# EAGLE schematic kicker (EAGLE 9.6.1)
DCHECKED: 08/28/19; DDRAWN: 08/04/19; DWG_NO: 1; FINISH: HASL; MATERIAL: FR-4; NCHECKED: Ryo Osawa; NDRAWN: Will Stuckey; REV: 3.2; SCALE: 1:1; TITLE: SSL Kicker

## Sheet 1 of 9: Power
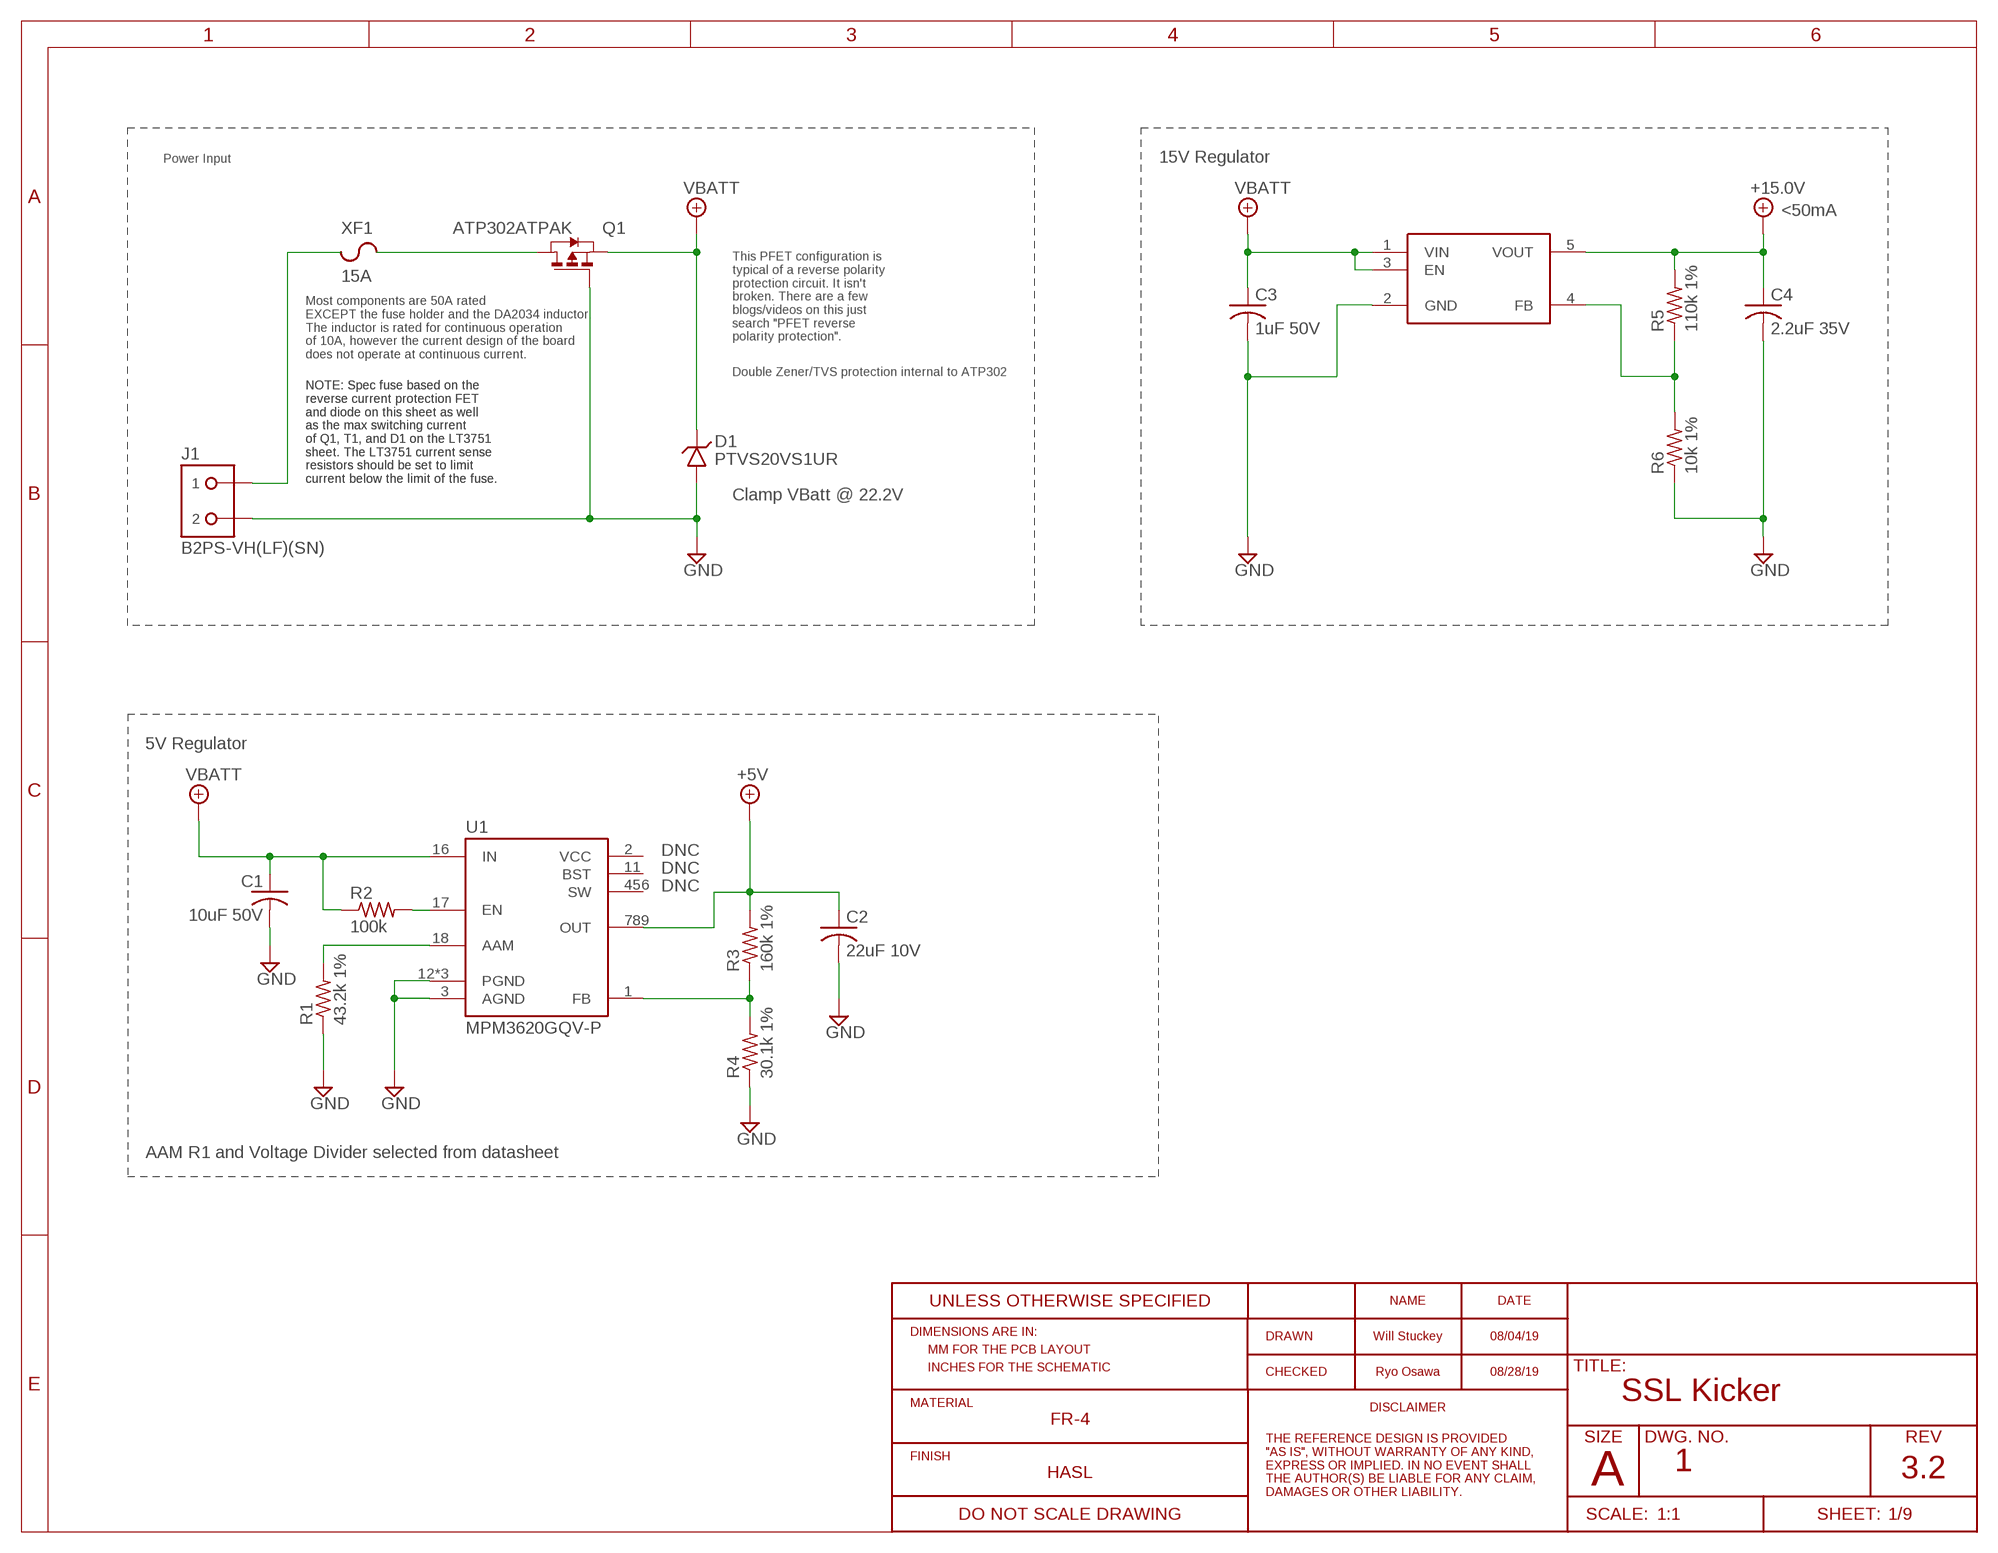
[diagram p0: schematic, sheet 1]
FRAME1 (RO_FRAME_A_L_20161226): REV: 3.2

### Parts
C1  10uF 50V  C-USC1206  [C1206]
C2  22uF 10V  C-USC0603  [C0603]
C3  1uF 50V  C-USC0603  [C0603]
C4  2.2uF 35V  C-USC0603  [C0603]
D1  PTVS20VS1UR  TVSSOD123W  [SOD123-W]
J1  B2PS-VH(LF)(SN)  [B2PS-CENTERED]
Q1  ATP302ATPAK  [TO460P950X150-3]
R1  43.2k 1%  R-US_R0603  [R0603]
R2  100k  R-US_R0603  [R0603]
R3  160k 1%  R-US_R0603  [R0603]
R4  30.1k 1%  R-US_R0603  [R0603]
R5  110k 1%  R-US_R0603  [R0603]
R6  10k 1%  R-US_R0603  [R0603]
U1  MPM3620GQV-P  [MPM3620GQV-P]
U2  15V  MIC5235YM5SOT-23-5  [SOT95P280X145-5]
XF1  15A  3557-2  [3557-2]

### Nets
+5V: C2.1 R3.2 U1.789(OUT) ; also sheet 3,6,7,8,9
+15.0V: C4.1 R5.2 U2.5(VOUT) ; also sheet 4,7
FB: R3.1 R4.2 U1.1(FB)
GND: C1.2 C2.2 C3.2 C4.2 D1.A J1.2 Q1.1(G) R1.1 R4.1 R6.1 U1.3(AGND) U1.12(PGND) U1.13(PGND) U1.14(PGND) U2.2(GND) ; also sheet 2,3,4,5,6,7,8,9
N$9: Q1.3(D) XF1.3 XF1.4
N$16: R5.1 R6.2 U2.4(FB)
N$39: J1.1 XF1.1 XF1.2
REG_AAM: R1.2 U1.18(AAM)
REG_EN: R2.2 U1.17(EN)
VBATT: C1.1 C3.1 D1.C Q1.2(S) R2.1 U1.16(IN) U2.1(VIN) U2.3(EN) ; also sheet 2,3,5
Unconnected: U1.2(VCC) U1.11(BST) U1.456(SW)

### Notes on the sheet
- Power Input | 15V Regulator
- <50mA
- This PFET configuration is 
  typical of a reverse polarity 
  protection circuit. It isn't 
  broken. There are a few 
  blogs/videos on this just 
  search "PFET reverse 
  polarity protection".
- Most components are 50A rated
  EXCEPT the fuse holder and the DA2034 inductor.
  The inductor is rated for continuous operation
  of 10A, however the current design of the board 
  does not operate at continuous current.
- Double Zener/TVS protection internal to ATP302
- NOTE: Spec fuse based on the
  reverse current protection FET
  and diode on this sheet as well
  as the max switching current
  of Q1, T1, and D1 on the LT3751
  sheet. The LT3751 current sense
  resistors should be set to limit
  current below the limit of the fuse.
- NOTE: Spec fuse based on the
  reverse current protection FET
  and diode on this sheet as well
  as the max switching current
  of Q1, T1, and D1 on the LT3751
  sheet. The LT3751 current sense
  resistors should be set to limit
  current below the limit of the fuse.
- Clamp VBatt @ 22.2V
- 5V Regulator
- DNC
- DNC
- DNC
- AAM R1 and Voltage Divider selected from datasheet

## Sheet 2 of 9: HV - Regulation
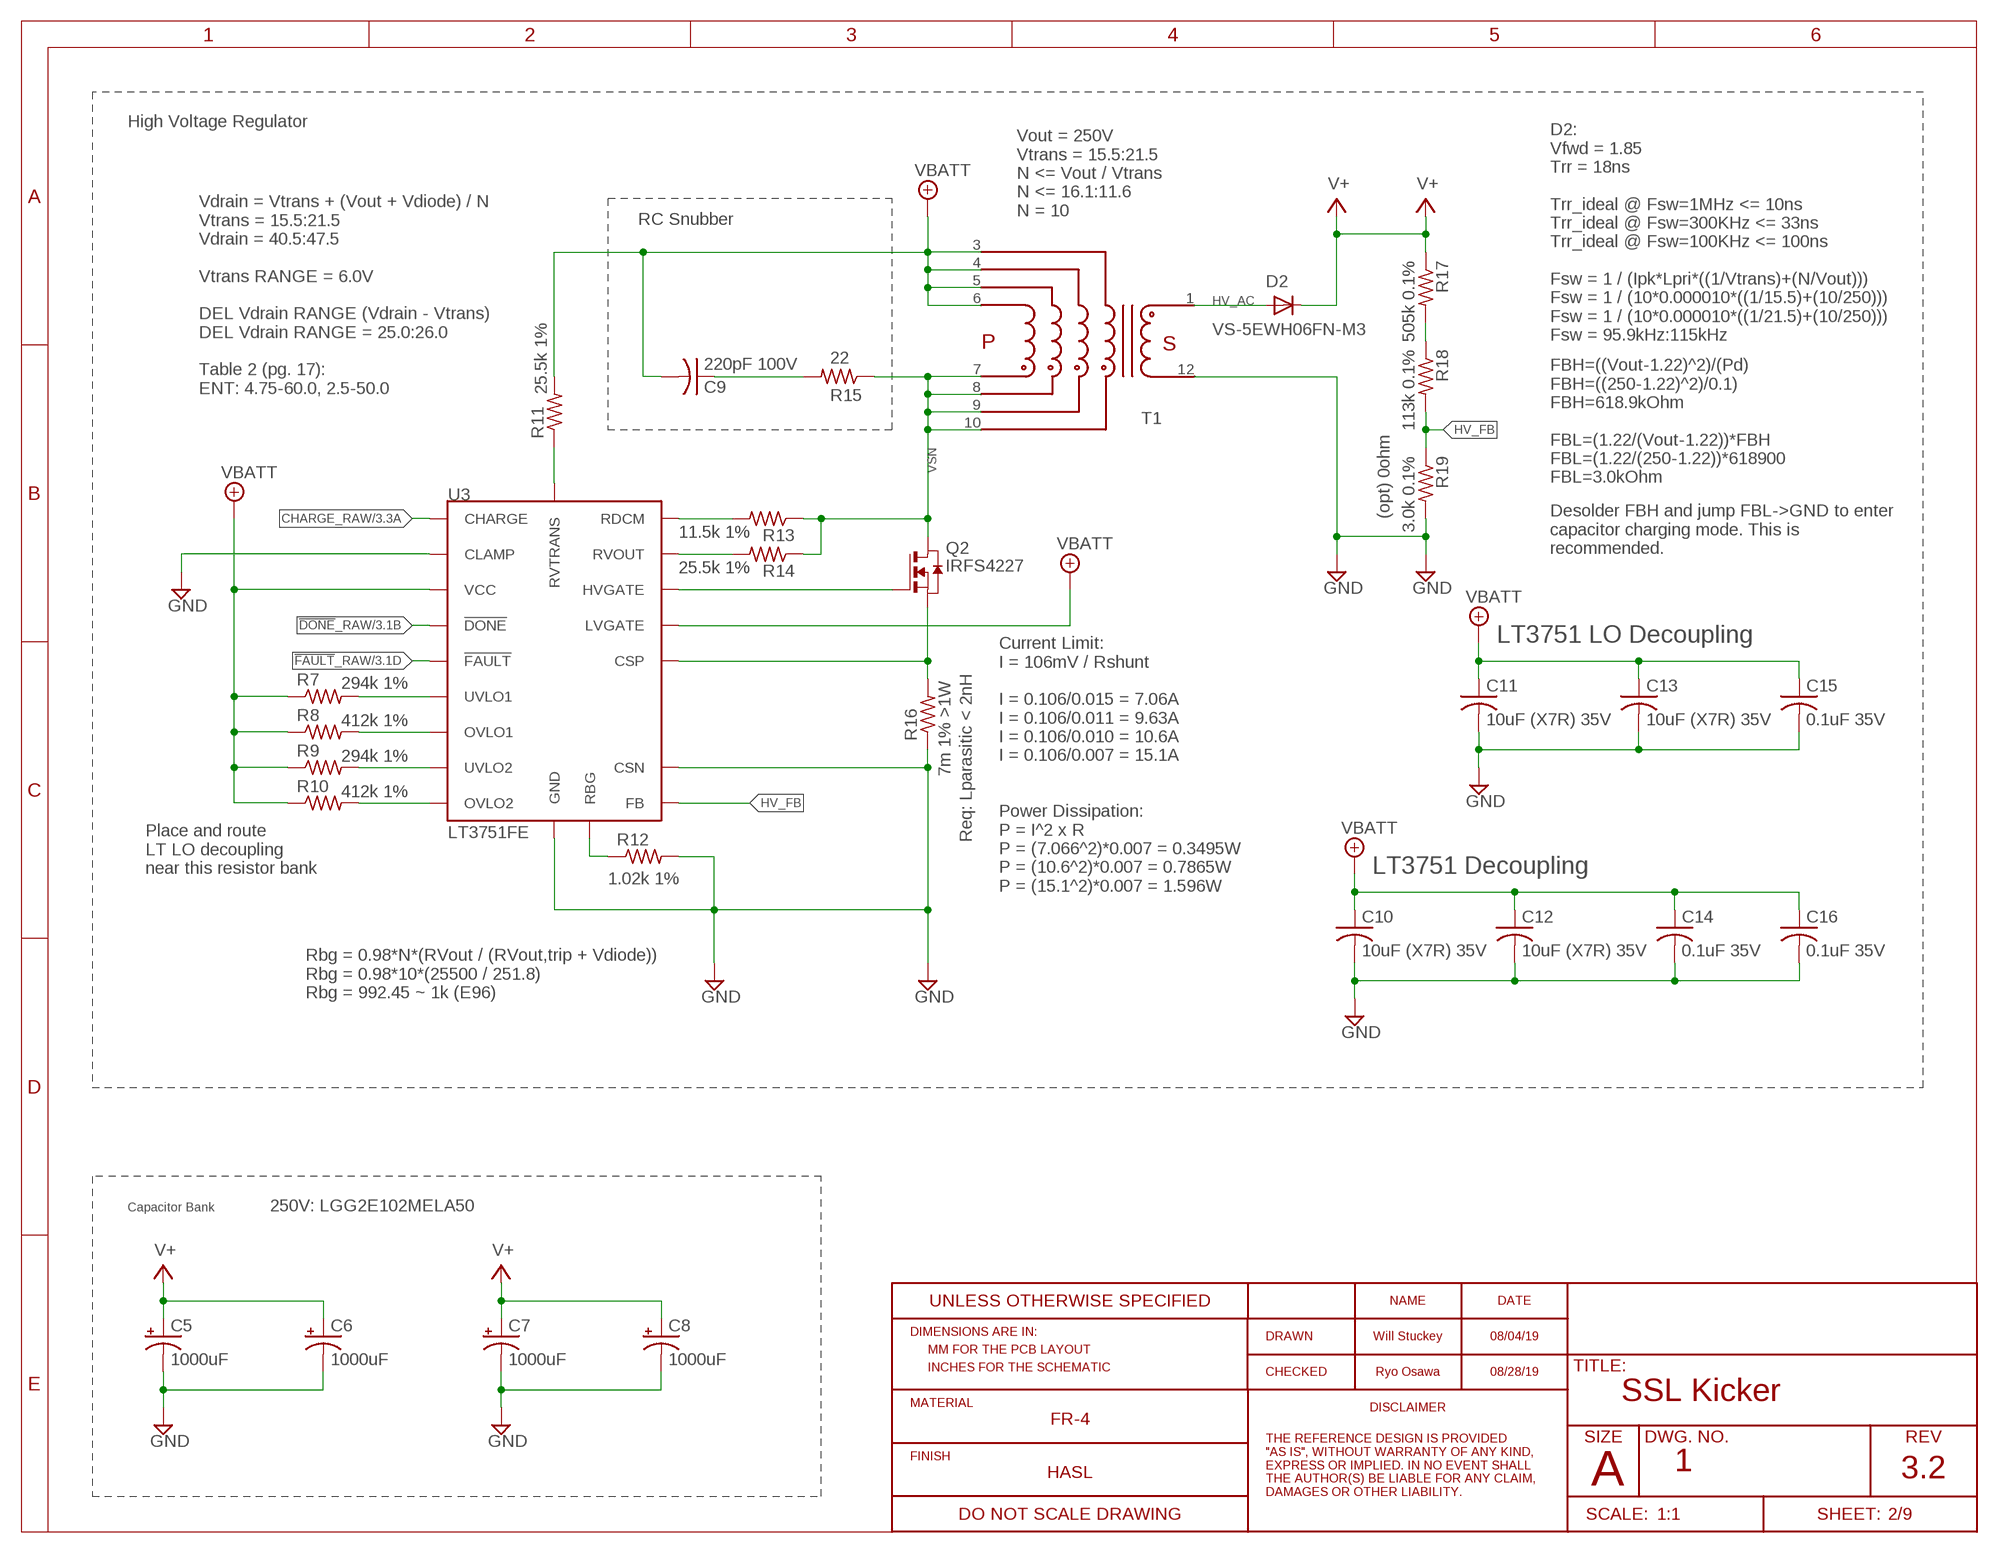
[diagram p1: schematic, sheet 2]
FRAME2 (RO_FRAME_A_L_20161226): REV: 3.2

### Parts
C5  1000uF  CPOL-USEB25D  [EB25D]
C6  1000uF  CPOL-USEB25D  [EB25D]
C7  1000uF  CPOL-USEB25D  [EB25D]
C8  1000uF  CPOL-USEB25D  [EB25D]
C9  220pF 100V  C-USC0805  [C0805]
C10  10uF (X7R) 35V  C-USC1210  [C1210]
C11  10uF (X7R) 35V  C-USC1210  [C1210]
C12  10uF (X7R) 35V  C-USC1210  [C1210]
C13  10uF (X7R) 35V  C-USC1210  [C1210]
C14  0.1uF 35V  C-USC0603  [C0603]
C15  0.1uF 35V  C-USC0603  [C0603]
C16  0.1uF 35V  C-USC0603  [C0603]
D2  VS-5EWH06FN-M3  VS-5EWH06FN-M3D-PAK_TO252AA  [TO460P990X239-3]
Q2  IRFS4227  [D2PAK]
R7  294k 1%  R-US_R0603  [R0603]
R8  412k 1%  R-US_R0603  [R0603]
R9  294k 1%  R-US_R0603  [R0603]
R10  412k 1%  R-US_R0603  [R0603]
R11  25.5k 1%  R-US_R0603  [R0603]
R12  1.02k 1%  R-US_R0805  [R0805]
R13  11.5k 1%  R-US_R0805  [R0805]
R14  25.5k 1%  R-US_R0805  [R0805]
R15  22  R-US_R0805  [R0805]
R16  7m 1% >1W  R-US_R2512  [R2512]
R17  505k 0.1%  R-US_R0603  [R0603]
R18  113k 0.1%  R-US_R0603  [R0603]
R19  3.0k 0.1%  R-US_R0603  [R0603]
T1  DA203X-ALDA2034  [DA2034]
U3  LT3751FE  [TSSOP-20_EP]

### Nets
!DONE!_RAW: U3.7(!DONE) ; also sheet 3,7
!FAULT!_RAW: U3.6(!FAULT) ; also sheet 3,7
CHARGE_RAW: U3.8(CHARGE) ; also sheet 3
CSP: Q2.3(S) R16.2 U3.12(CSP)
GND: C5.- C6.- C7.- C8.- C10.2 C11.2 C12.2 C13.2 C14.2 C15.2 C16.2 R12.2 R16.1 R19.2 T1.12 U3.9(CLAMP) U3.11(CSN) U3.PAD(GND) ; also sheet 1,3,4,5,6,7,8,9
HV_AC: D2.2(A) T1.1
HV_FB: R18.2 R19.1 U3.10(FB)
HVGATE: Q2.1(G) U3.15(HVGATE)
N$1: R12.1 U3.16(RBG)
N$2: R17.2 R18.1
N$18: C9.1 R15.2
N$24: R11.1 U3.1(RVTRANS)
OVLO1: R8.2 U3.3(OVLO1)
OVLO2: R10.2 U3.5(OVLO2)
RDCM: R13.2 U3.20(RDCM)
RVOUT: R14.2 U3.18(RVOUT)
UVLO1: R7.2 U3.2(UVLO1)
UVLO2: R9.2 U3.4(UVLO2)
V+: C5.+ C6.+ C7.+ C8.+ D2.3(C) R17.1 ; also sheet 4,5,6,7
VBATT: C9.2 C10.1 C11.1 C12.1 C13.1 C14.1 C15.1 C16.1 R7.1 R8.1 R9.1 R10.1 R11.2 T1.3 T1.4 T1.5 T1.6 U3.13(VCC) U3.14(LVGATE) ; also sheet 1,3,5
VSN: Q2.2(D) R13.1 R14.1 R15.1 T1.7 T1.8 T1.9 T1.10

### Notes on the sheet
- High Voltage Regulator
- Vout = 250V
  Vtrans = 15.5:21.5
  N <= Vout / Vtrans
  N <= 16.1:11.6
  N = 10
- RC Snubber
- D2:
  Vfwd = 1.85
  Trr = 18ns
  
  Trr_ideal @ Fsw=1MHz <= 10ns
  Trr_ideal @ Fsw=300KHz <= 33ns
  Trr_ideal @ Fsw=100KHz <= 100ns
  
  Fsw = 1 / (Ipk*Lpri*((1/Vtrans)+(N/Vout)))
  Fsw = 1 / (10*0.000010*((1/15.5)+(10/250)))
  Fsw = 1 / (10*0.000010*((1/21.5)+(10/250)))
  Fsw = 95.9kHz:115kHz
- Vdrain = Vtrans + (Vout + Vdiode) / N
  Vtrans = 15.5:21.5
  Vdrain = 40.5:47.5
  
  Vtrans RANGE = 6.0V
  
  DEL Vdrain RANGE (Vdrain - Vtrans)
  DEL Vdrain RANGE = 25.0:26.0
  
  Table 2 (pg. 17):
  ENT: 4.75-60.0, 2.5-50.0
- FBH=((Vout-1.22)^2)/(Pd)
  FBH=((250-1.22)^2)/0.1)
  FBH=618.9kOhm
  
  FBL=(1.22/(Vout-1.22))*FBH
  FBL=(1.22/(250-1.22))*618900
  FBL=3.0kOhm
- (opt) 0ohm
- Desolder FBH and jump FBL->GND to enter
  capacitor charging mode. This is
  recommended.
- LT3751 LO Decoupling
- Req: Lparasitic < 2nH
- Place and route 
  LT LO decoupling 
  near this resistor bank
- LT3751 Decoupling
- Current Limit:
  I = 106mV / Rshunt
  
  I = 0.106/0.015 = 7.06A
  I = 0.106/0.011 = 9.63A
  I = 0.106/0.010 = 10.6A
  I = 0.106/0.007 = 15.1A
  
  
  Power Dissipation:
  P = I^2 x R
  P = (7.066^2)*0.007 = 0.3495W
  P = (10.6^2)*0.007 = 0.7865W
  P = (15.1^2)*0.007 = 1.596W
- Rbg = 0.98*N*(RVout / (RVout,trip + Vdiode))
  Rbg = 0.98*10*(25500 / 251.8)
  Rbg = 992.45 ~ 1k (E96)
- Capacitor Bank | 250V: LGG2E102MELA50

## Sheet 3 of 9: HV - Control & Bypass
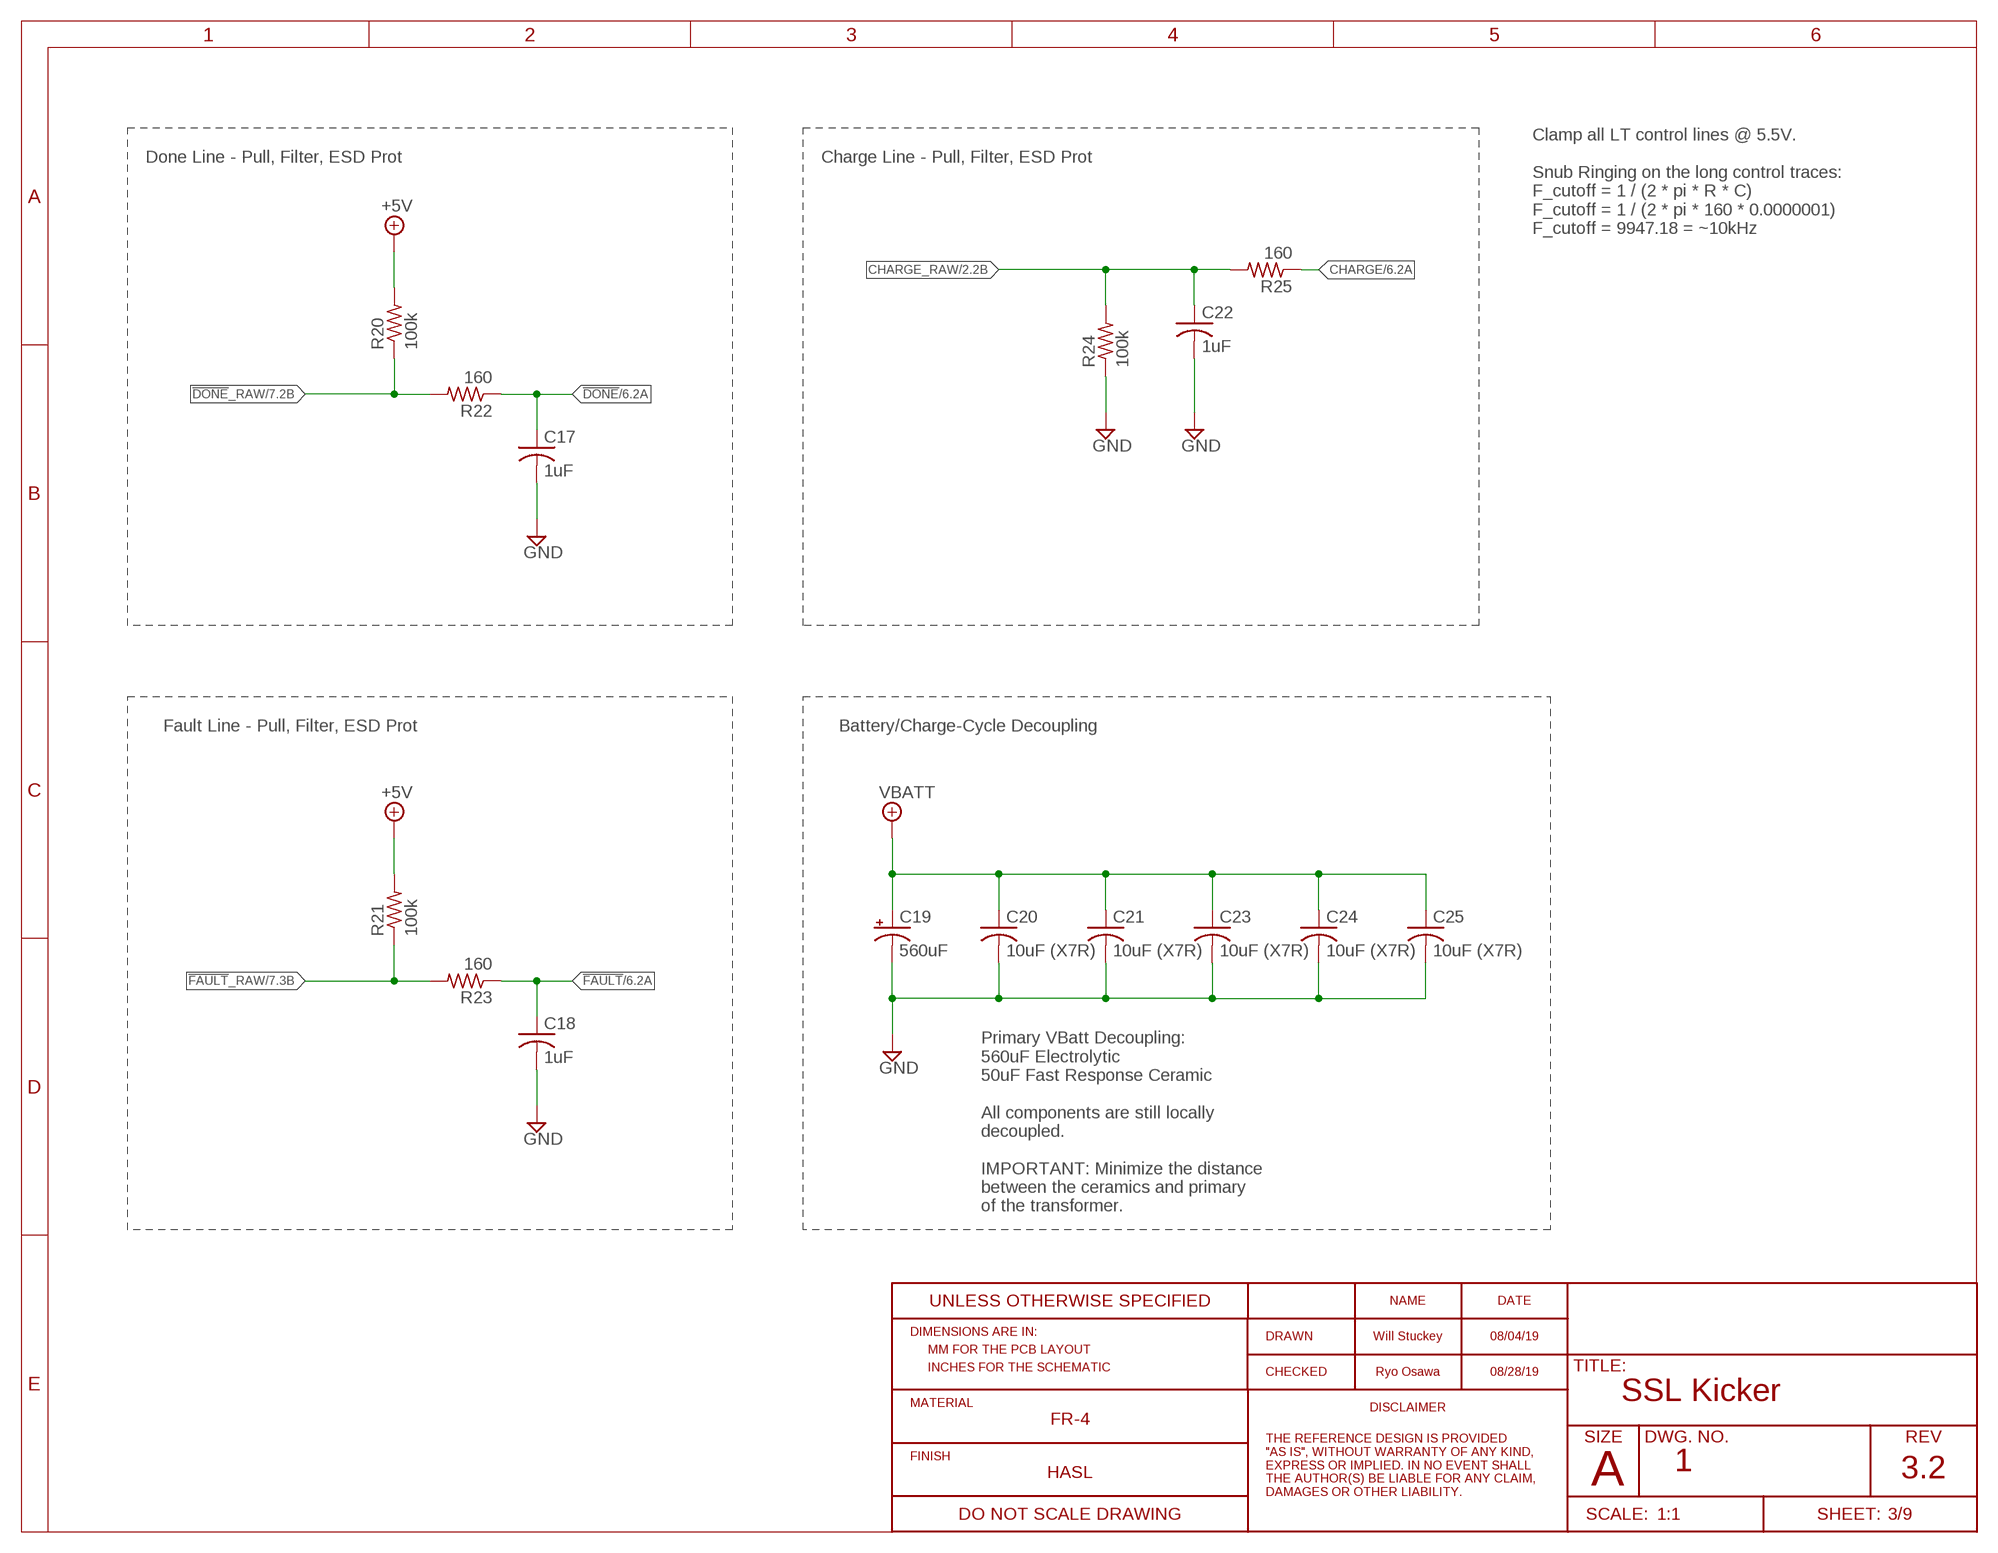
[diagram p2: schematic, sheet 3]

### Parts
C17  1uF  C-USC0603  [C0603]
C18  1uF  C-USC0603  [C0603]
C19  560uF  CPOL-USE7,5-18  [E7,5-18]
C20  10uF (X7R)  C-USC1210  [C1210]
C21  10uF (X7R)  C-USC1210  [C1210]
C22  1uF  C-USC0603  [C0603]
C23  10uF (X7R)  C-USC1210  [C1210]
C24  10uF (X7R)  C-USC1210  [C1210]
C25  10uF (X7R)  C-USC1210  [C1210]
R20  100k  R-US_R0603  [R0603]
R21  100k  R-US_R0603  [R0603]
R22  160  R-US_R0603  [R0603]
R23  160  R-US_R0603  [R0603]
R24  100k  R-US_R0603  [R0603]
R25  160  R-US_R0603  [R0603]

### Nets
!DONE!: C17.1 R22.1 ; also sheet 6
!DONE!_RAW: R20.1 R22.2 ; also sheet 2,7
!FAULT!: C18.1 R23.1 ; also sheet 6
!FAULT!_RAW: R21.1 R23.2 ; also sheet 2,7
+5V: R20.2 R21.2 ; also sheet 1,6,7,8,9
CHARGE: R25.1 ; also sheet 6
CHARGE_RAW: C22.1 R24.2 R25.2 ; also sheet 2
GND: C17.2 C18.2 C19.- C20.2 C21.2 C22.2 C23.2 C24.2 C25.2 R24.1 ; also sheet 1,2,4,5,6,7,8,9
VBATT: C19.+ C20.1 C21.1 C23.1 C24.1 C25.1 ; also sheet 1,2,5

### Notes on the sheet
- Done Line - Pull, Filter, ESD Prot | Charge Line - Pull, Filter, ESD Prot
- Clamp all LT control lines @ 5.5V.
  
  Snub Ringing on the long control traces:
  F_cutoff = 1 / (2 * pi * R * C)
  F_cutoff = 1 / (2 * pi * 160 * 0.0000001)
  F_cutoff = 9947.18 = ~10kHz
- Fault Line - Pull, Filter, ESD Prot | Battery/Charge-Cycle Decoupling
- Primary VBatt Decoupling:
  560uF Electrolytic
  50uF Fast Response Ceramic
  
  All components are still locally
  decoupled.
  
  IMPORTANT: Minimize the distance
  between the ceramics and primary
  of the transformer.

## Sheet 4 of 9: HV - Kick Discharge
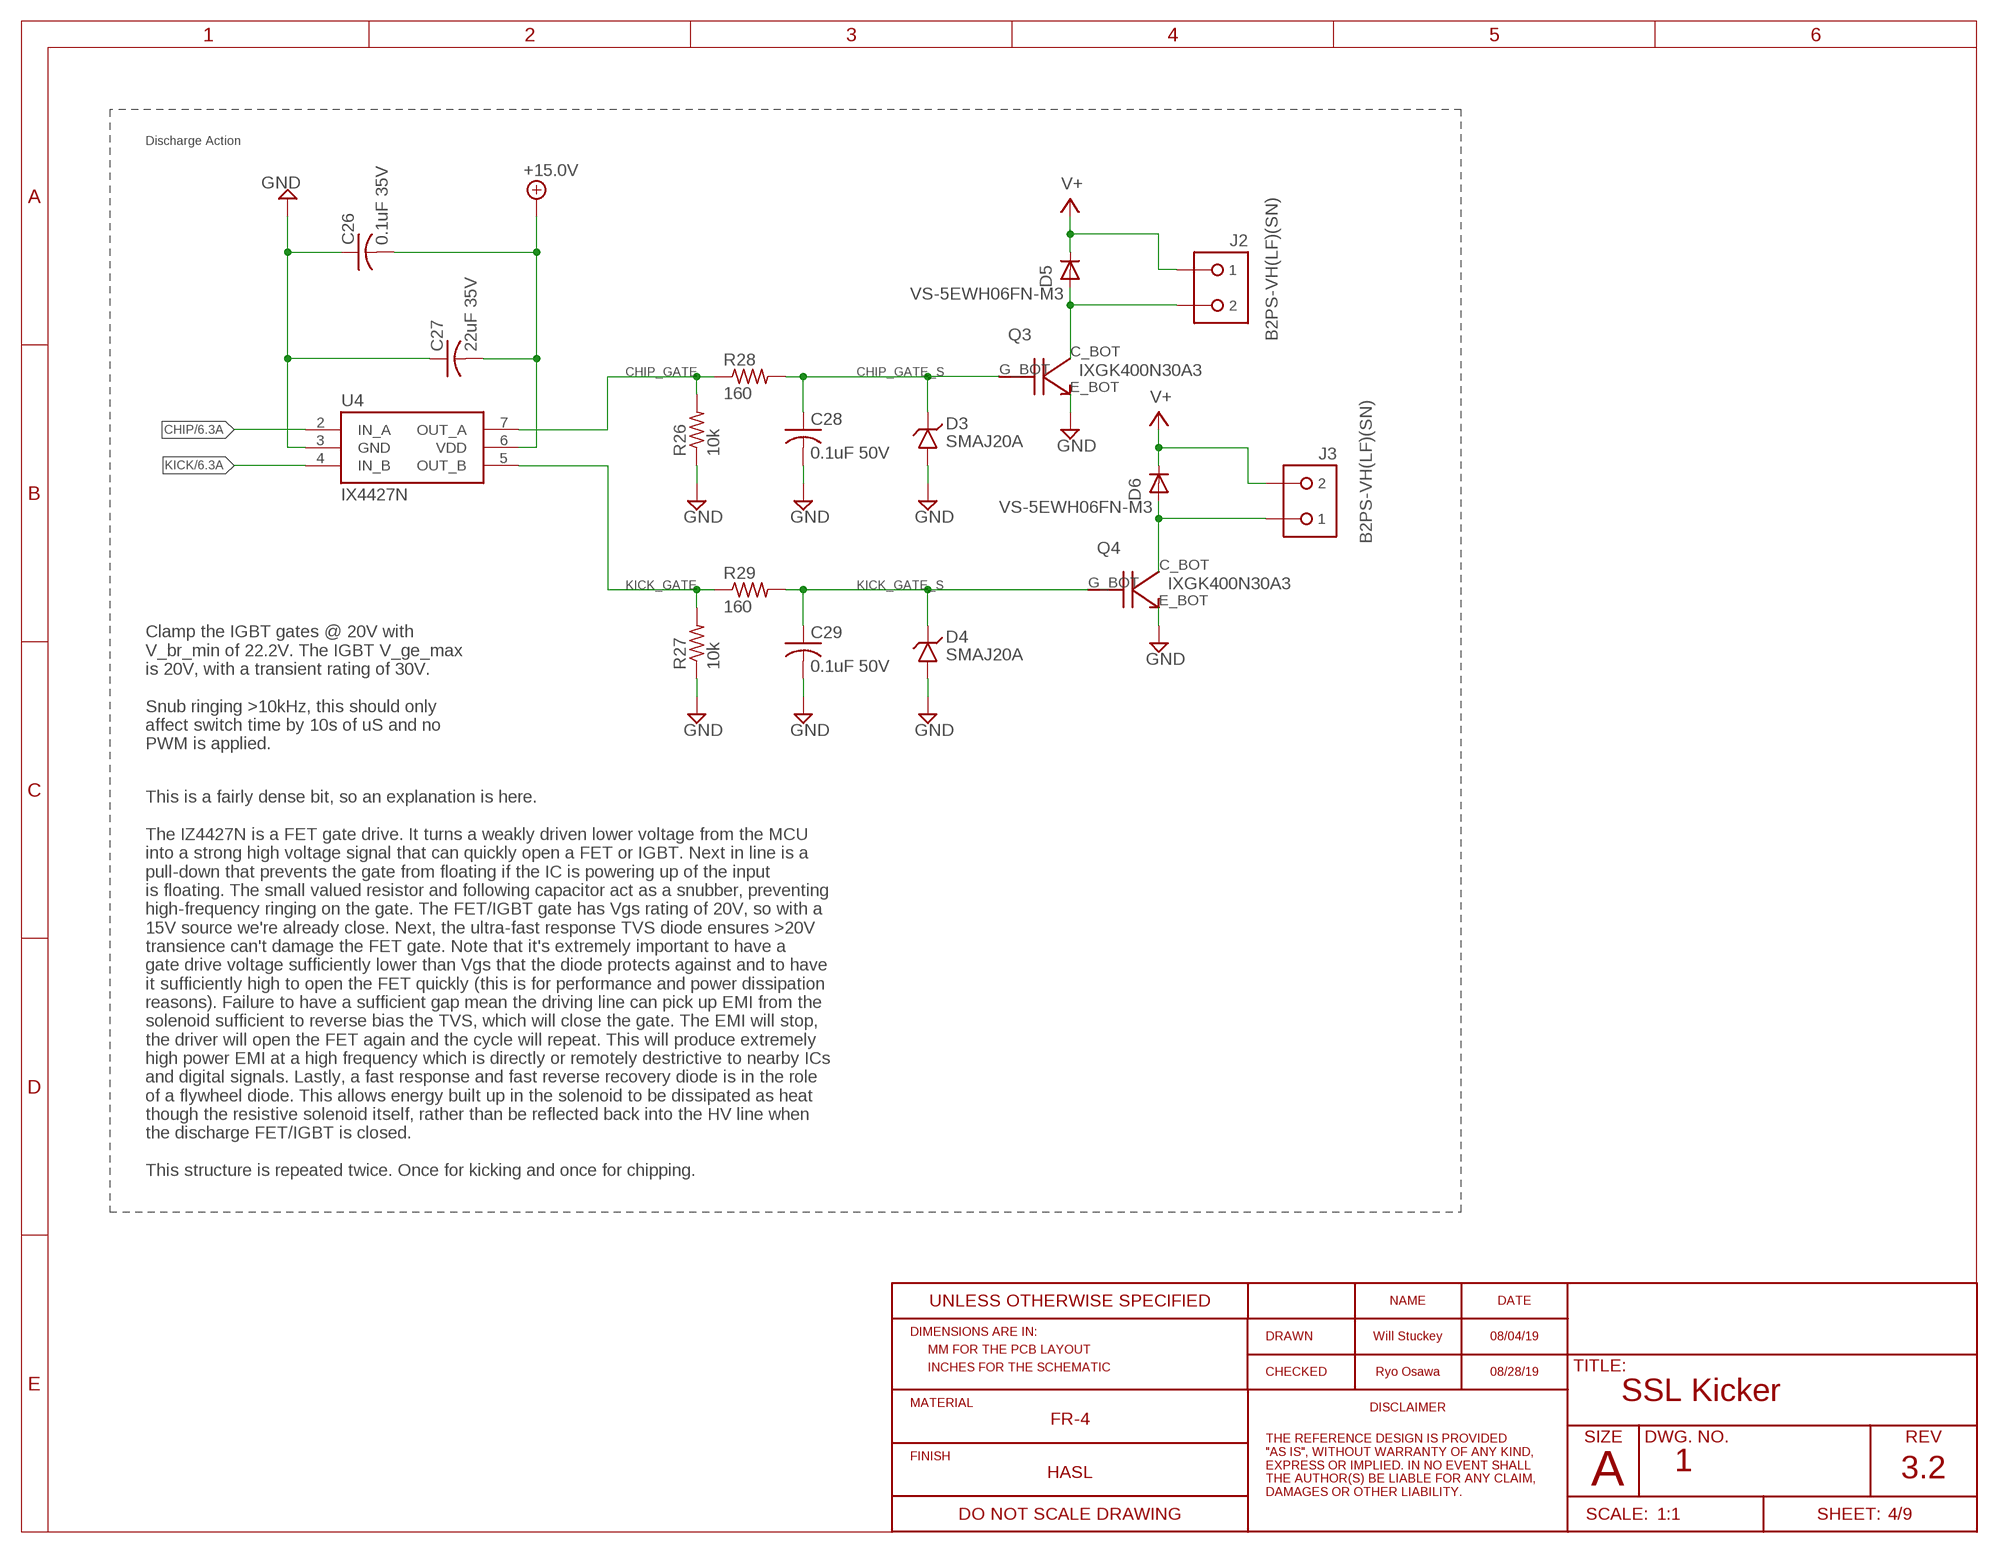
[diagram p3: schematic, sheet 4]

### Parts
C26  0.1uF 35V  C-USC0603  [C0603]
C27  22uF 35V  C-USC0603  [C0603]
C28  0.1uF 50V  C-USC0603  [C0603]
C29  0.1uF 50V  C-USC0603  [C0603]
D3  SMAJ20A  SMAJ20ADO-214AC  [RESM5226X262]
D4  SMAJ20A  SMAJ20ADO-214AC  [RESM5226X262]
D5  VS-5EWH06FN-M3  VS-5EWH06FN-M3D-PAK_TO252AA  [TO460P990X239-3]
D6  VS-5EWH06FN-M3  VS-5EWH06FN-M3D-PAK_TO252AA  [TO460P990X239-3]
J2  B2PS-VH(LF)(SN)  [B2PS-CENTERED]
J3  B2PS-VH(LF)(SN)  [B2PS-CENTERED]
Q3  IXGK400N30A3  [TO264]
Q4  IXGK400N30A3  [TO264]
R26  10k  R-US_R0603  [R0603]
R27  10k  R-US_R0603  [R0603]
R28  160  R-US_R1206  [R1206]
R29  160  R-US_R1206  [R1206]
U4  IX4427N  [SOIC-8]

### Nets
+15.0V: C26.2 C27.2 U4.6(VDD) ; also sheet 1,7
CHIP: U4.2(IN_A) ; also sheet 6
CHIP_GATE: R26.2 R28.1 U4.7(OUT_A)
CHIP_GATE_S: C28.1 D3.2(C) Q3.G_BOT(G) R28.2
CHIPPER: D5.2(A) J2.2 Q3.C_BOT(C)
GND: C26.1 C27.1 C28.2 C29.2 D3.1(A) D4.1(A) Q3.E_BOT(E) Q4.E_BOT(E) R26.1 R27.1 U4.3(GND) ; also sheet 1,2,3,5,6,7,8,9
KICK: U4.4(IN_B) ; also sheet 6
KICK_GATE: R27.2 R29.1 U4.5(OUT_B)
KICK_GATE_S: C29.1 D4.2(C) Q4.G_BOT(G) R29.2
KICKER: D6.2(A) J3.1 Q4.C_BOT(C)
V+: D5.3(C) D6.3(C) J2.1 J3.2 ; also sheet 2,5,6,7

### Notes on the sheet
- Discharge Action
- Clamp the IGBT gates @ 20V with
  V_br_min of 22.2V. The IGBT V_ge_max 
  is 20V, with a transient rating of 30V.
  
  Snub ringing >10kHz, this should only
  affect switch time by 10s of uS and no
  PWM is applied.
- This is a fairly dense bit, so an explanation is here. 
  
  The IZ4427N is a FET gate drive. It turns a weakly driven lower voltage from the MCU
  into a strong high voltage signal that can quickly open a FET or IGBT. Next in line is a
  pull-down that prevents the gate from floating if the IC is powering up of the input
  is floating. The small valued resistor and following capacitor act as a snubber, preventing
  high-frequency ringing on the gate. The FET/IGBT gate has Vgs rating of 20V, so with a
  15V source we're already close. Next, the ultra-fast response TVS diode ensures >20V
  transience can't damage the FET gate. Note that it's extremely important to have a 
  gate drive voltage sufficiently lower than Vgs that the diode protects against and to have
  it sufficiently high to open the FET quickly (this is for performance and power dissipation
  reasons). Failure to have a sufficient gap mean the driving line can pick up EMI from the
  solenoid sufficient to reverse bias the TVS, which will close the gate. The EMI will stop,
  the driver will open the FET again and the cycle will repeat. This will produce extremely
  high power EMI at a high frequency which is directly or remotely destrictive to nearby ICs
  and digital signals. Lastly, a fast response and fast reverse recovery diode is in the role
  of a flywheel diode. This allows energy built up in the solenoid to be dissipated as heat
  though the resistive solenoid itself, rather than be reflected back into the HV line when
  the discharge FET/IGBT is closed.
  
  This structure is repeated twice. Once for kicking and once for chipping.

## Sheet 5 of 9: HV - Auto Discharge
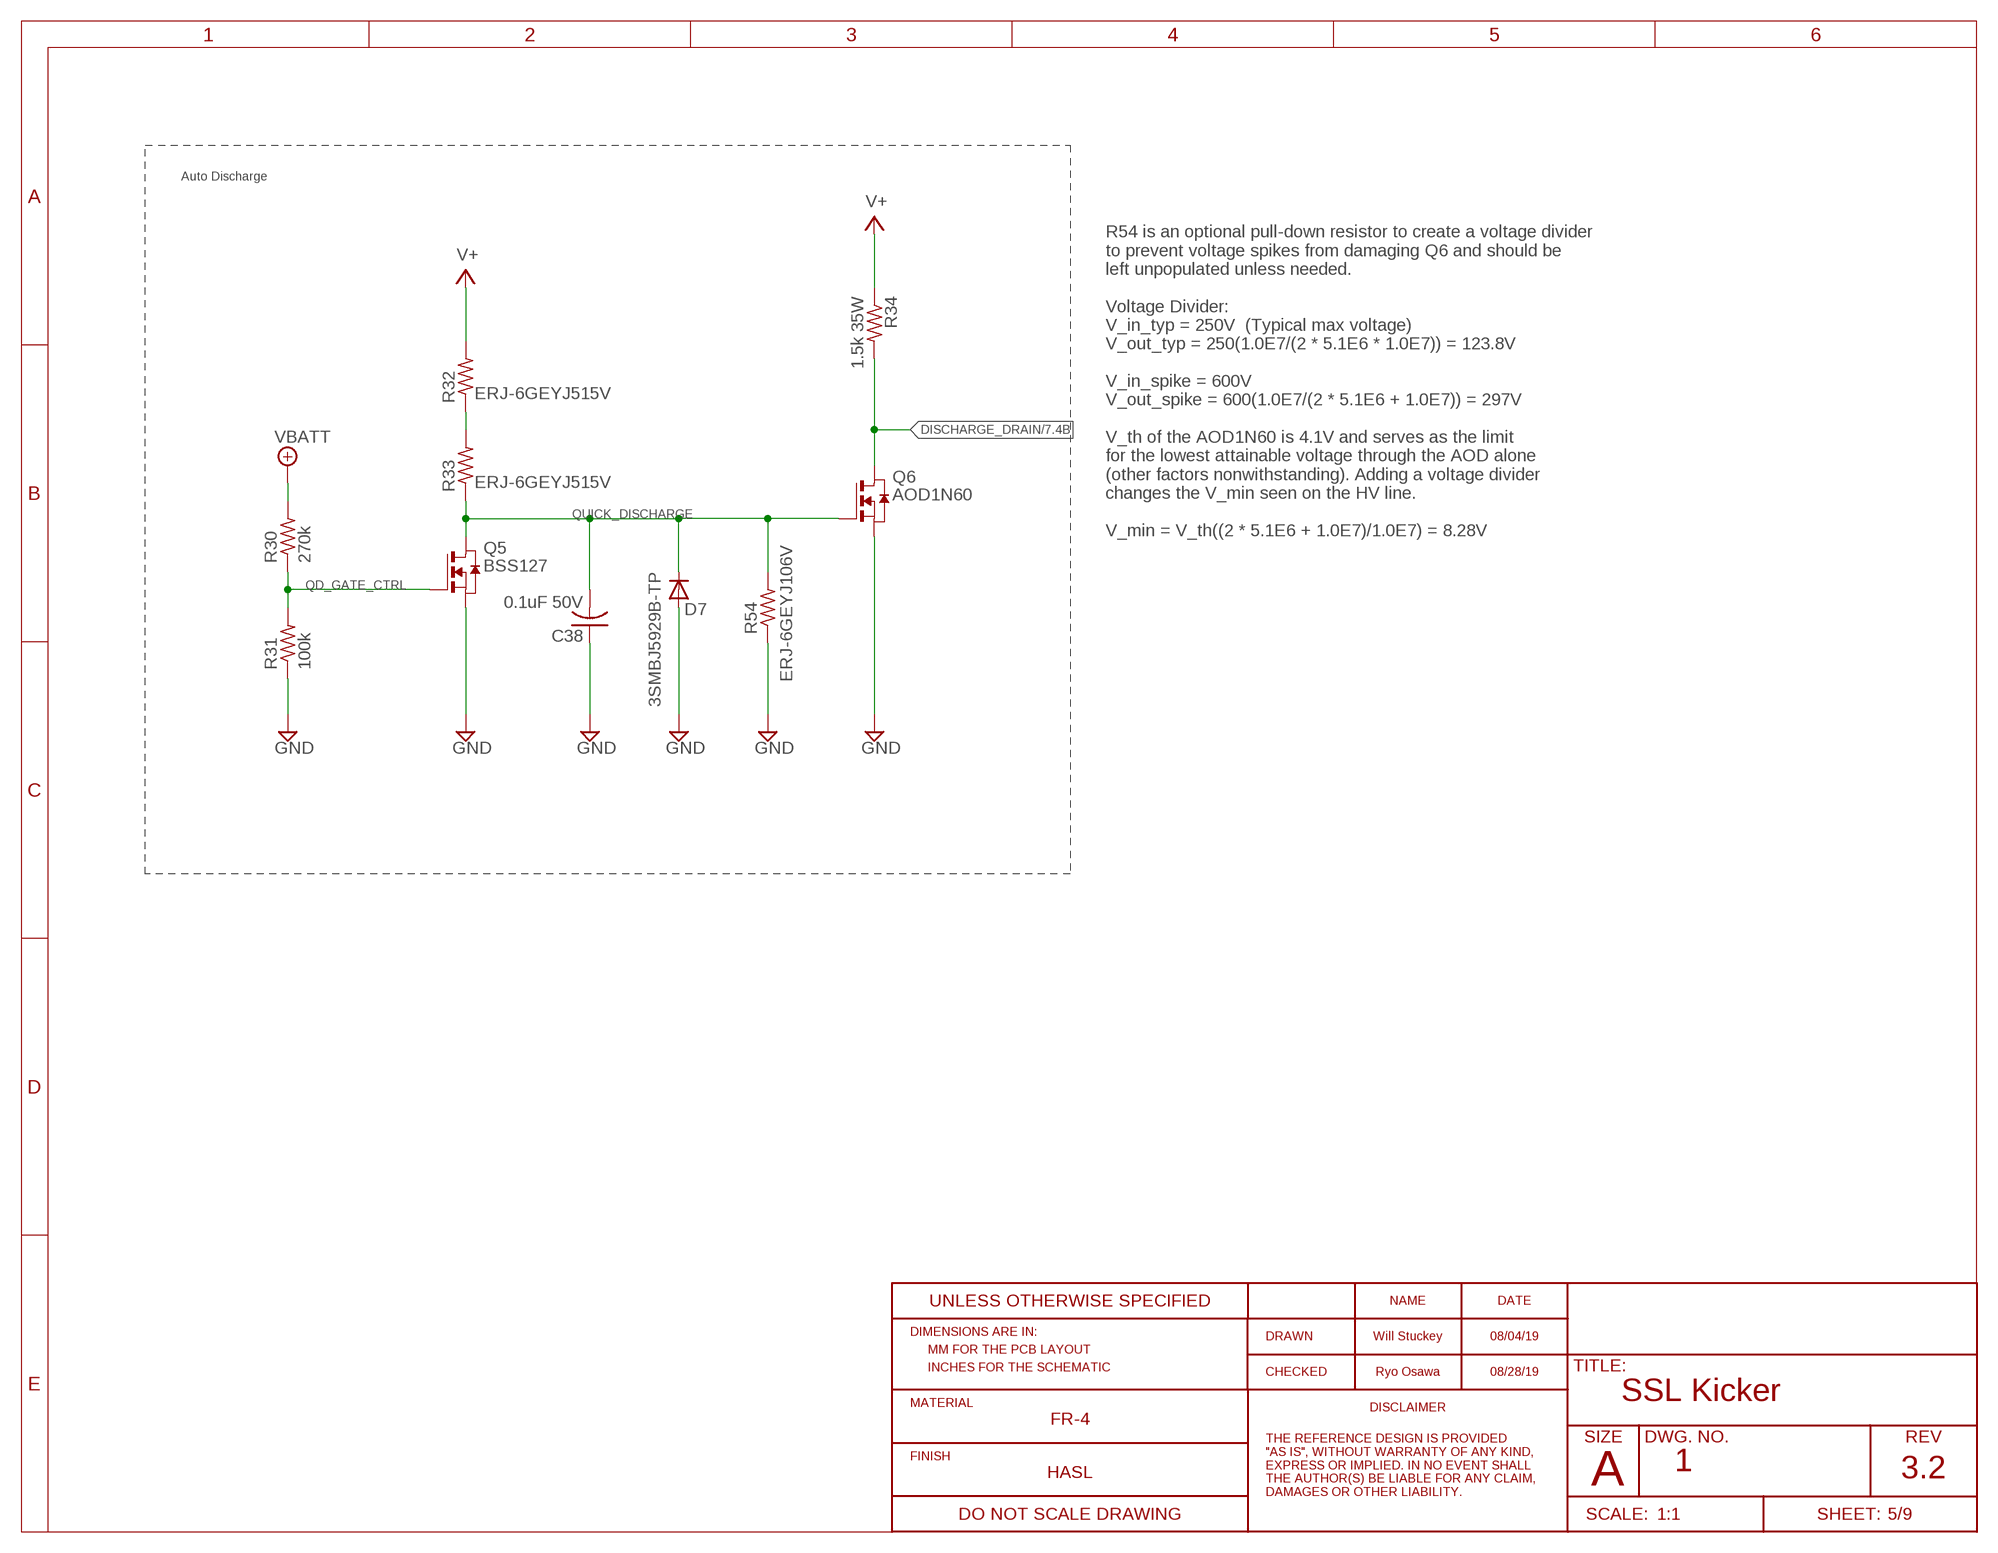
[diagram p4: schematic, sheet 5]
FRAME5 (RO_FRAME_A_L_20161226): REV: 3.2

### Parts
C38  0.1uF 50V  C-USC0603  [C0603]
D7  3SMBJ5929B-TP  DIODE-DO214AA  [DO214AA]
Q5  BSS127  [SOT-23-3]
Q6  AOD1N60  [DPAK]
R30  270k  R-US_R0603  [R0603]
R31  100k  R-US_R0603  [R0603]
R32  ERJ-6GEYJ515V  R-US_R0603  [R0603]
R33  ERJ-6GEYJ515V  R-US_R0805  [R0805]
R34  1.5k 35W  PWR263S-35TO-263AB  [TO508P1539X450-3]
R54  ERJ-6GEYJ106V  R-US_R0603  [R0603]

### Nets
DISCHARGE_DRAIN: Q6.FIN(D) R34.2(PIN2) ; also sheet 7
GND: C38.1 D7.A Q5.2(S) Q6.3(S) R31.1 R54.1 ; also sheet 1,2,3,4,6,7,8,9
QD_GATE_CTRL: Q5.1(G) R30.1 R31.2
QD_PU_BR: R32.1 R33.2
QUICK_DISCHARGE: C38.2 D7.C Q5.3(D) Q6.1(G) R33.1 R54.2
V+: R32.2 R34.1(PIN1) ; also sheet 2,4,6,7
VBATT: R30.2 ; also sheet 1,2,3

### Notes on the sheet
- Auto Discharge
- R54 is an optional pull-down resistor to create a voltage divider
  to prevent voltage spikes from damaging Q6 and should be
  left unpopulated unless needed.
  
  Voltage Divider:
  V_in_typ = 250V  (Typical max voltage)
  V_out_typ = 250(1.0E7/(2 * 5.1E6 * 1.0E7)) = 123.8V
  
  V_in_spike = 600V
  V_out_spike = 600(1.0E7/(2 * 5.1E6 + 1.0E7)) = 297V
  
  V_th of the AOD1N60 is 4.1V and serves as the limit 
  for the lowest attainable voltage through the AOD alone
  (other factors nonwithstanding). Adding a voltage divider
  changes the V_min seen on the HV line.
  
  V_min = V_th((2 * 5.1E6 + 1.0E7)/1.0E7) = 8.28V

## Sheet 6 of 9: MCU
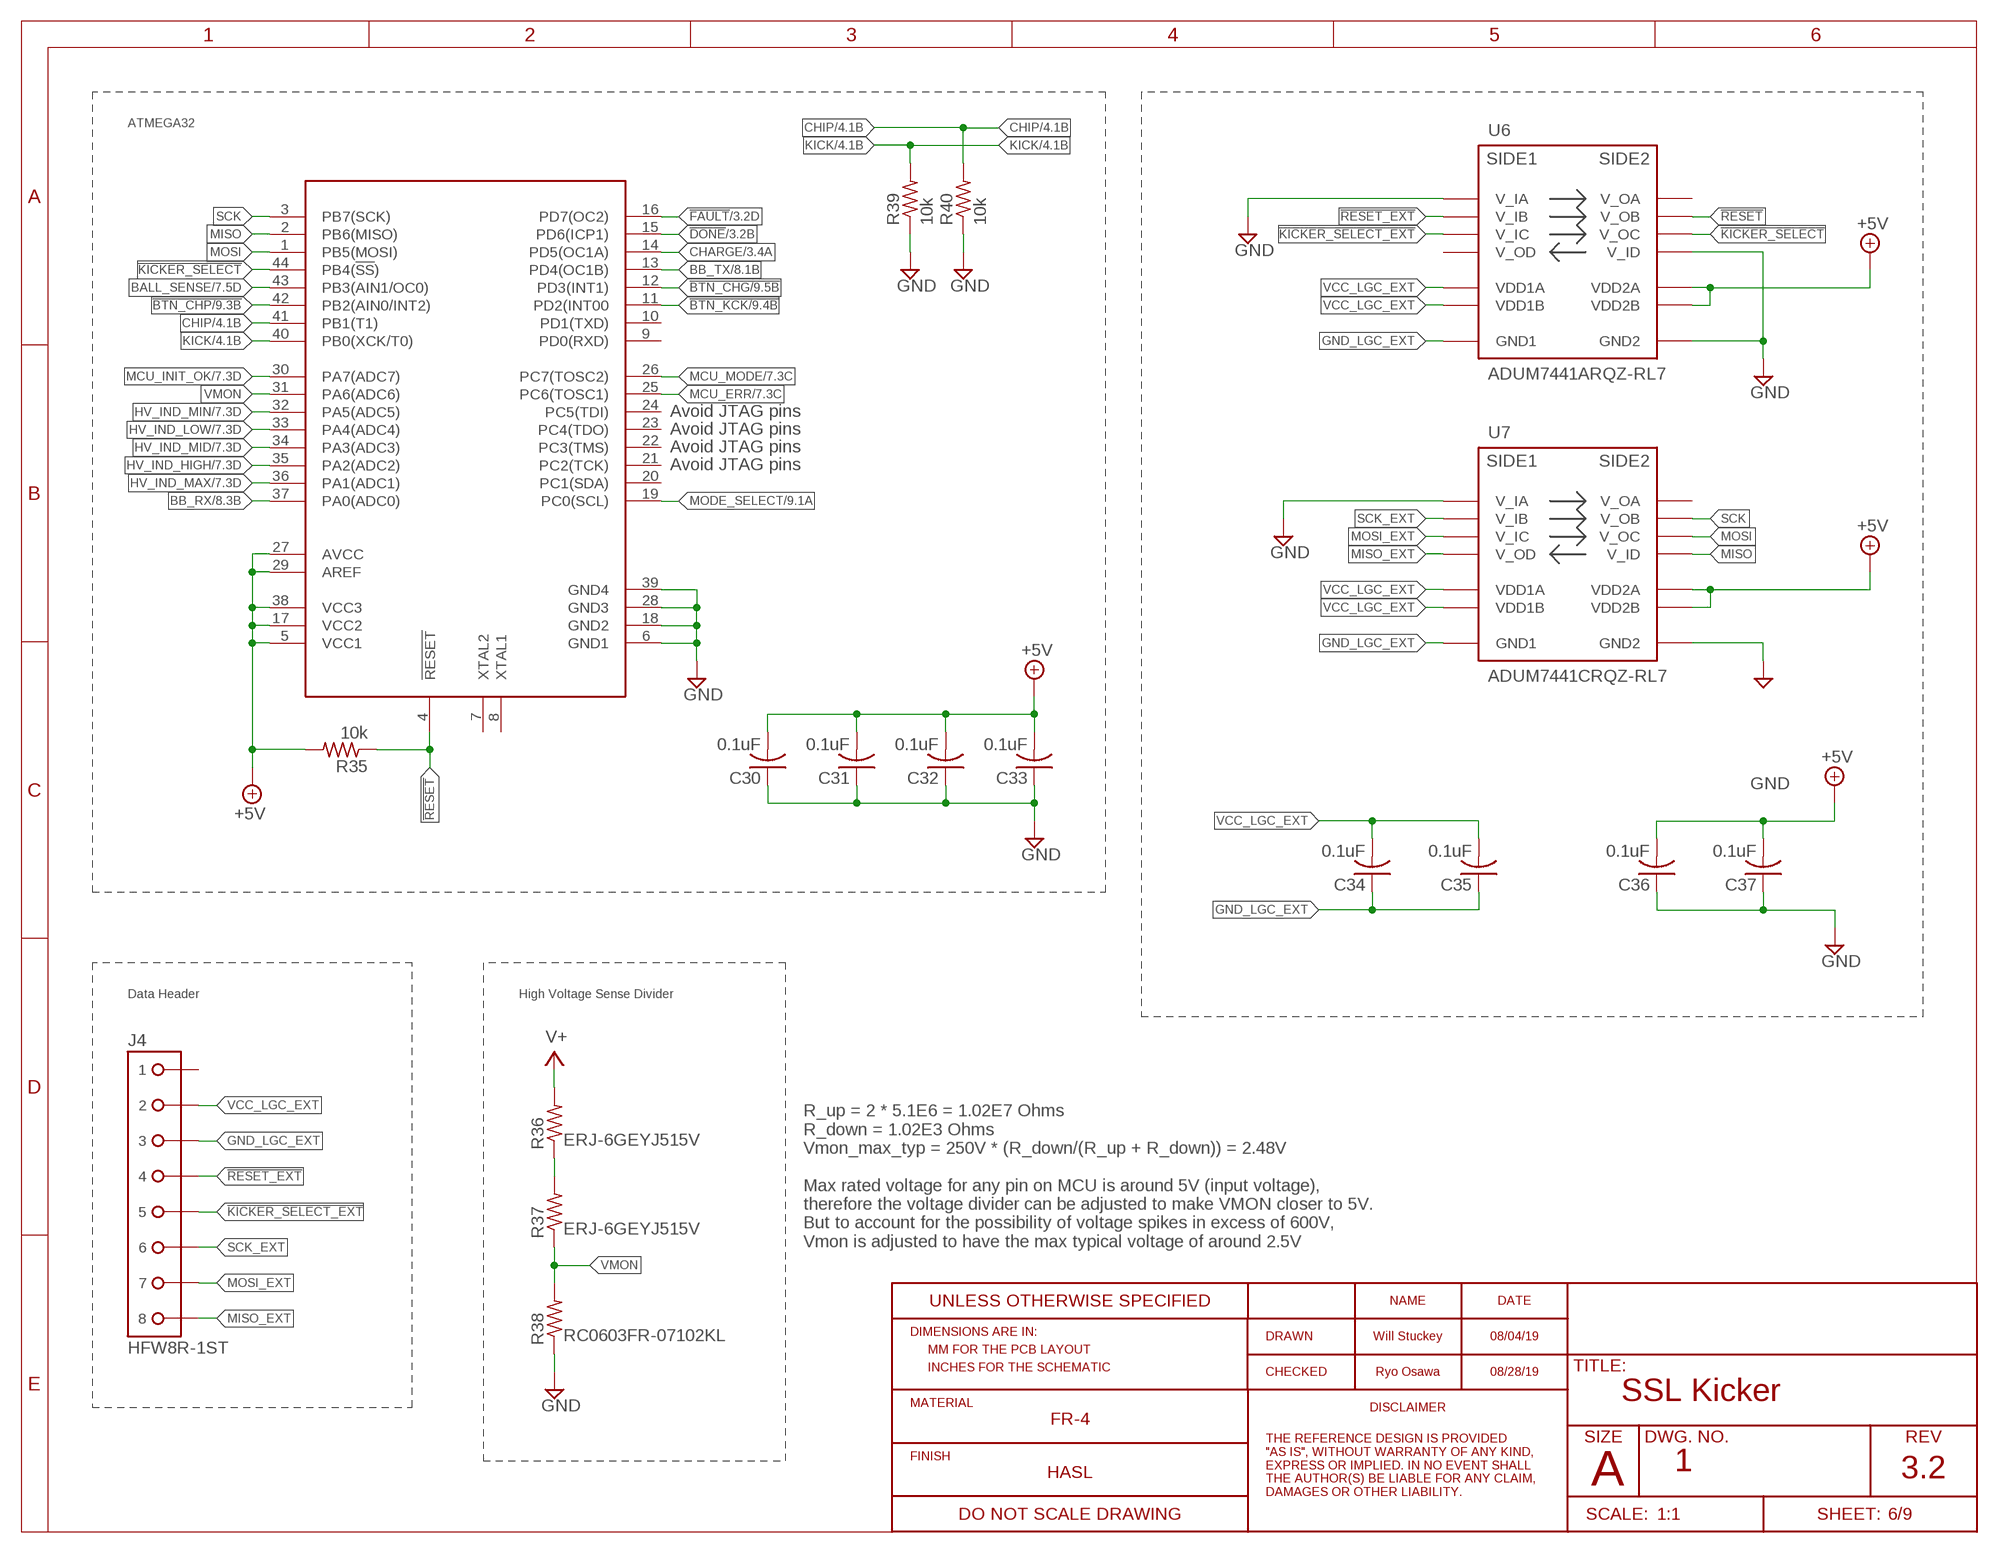
[diagram p5: schematic, sheet 6]
FRAME6 (RO_FRAME_A_L_20161226): REV: 3.2

### Parts
C30  0.1uF  C-USC0603  [C0603]
C31  0.1uF  C-USC0603  [C0603]
C32  0.1uF  C-USC0603  [C0603]
C33  0.1uF  C-USC0603  [C0603]
C34  0.1uF  C-USC0603  [C0603]
C35  0.1uF  C-USC0603  [C0603]
C36  0.1uF  C-USC0603  [C0603]
C37  0.1uF  C-USC0603  [C0603]
J4  HFW8R-1ST  [HFW8R-1ST]
R35  10k  R-US_R0603  [R0603]
R36  ERJ-6GEYJ515V  R-US_R0603  [R0603]
R37  ERJ-6GEYJ515V  R-US_R0603  [R0603]
R38  RC0603FR-07102KL  R-US_R0603  [R0603]
R39  10k  R-US_R0603  [R0603]
R40  10k  R-US_R0603  [R0603]
U5  AT32ATQFP44  [QFP80P1200X1200X120-44]
U6  ADUM7441ARQZ-RL7  ADUM744XARQZ-RL7  [SOP63P574X165-16]
U7  ADUM7441CRQZ-RL7  ADUM744XCRQZ-RL7  [SOP63P574X165-16]

### Nets
!BTN_CHG: U5.12(PD3(INT1)) ; also sheet 9
!BTN_CHP: U5.42(PB2(AIN0/INT2)) ; also sheet 9
!BTN_KCK: U5.11(PD2(INT00) ; also sheet 9
!DONE!: U5.15(PD6(ICP1)) ; also sheet 3
!FAULT!: U5.16(PD7(OC2)) ; also sheet 3
!KICKER_SELECT: U5.44(PB4(!SS!)) U6.12(V_OC)
!KICKER_SELECT_EXT: J4.5 U6.5(V_IC)
!RESET: R35.1 U5.4(!RESET!) U6.13(V_OB)
!RESET_EXT: J4.4 U6.4(V_IB)
+5V: C30.2 C31.2 C32.2 C33.2 C36.2 C37.2 R35.2 U5.5(VCC1) U5.17(VCC2) U5.27(AVCC) U5.29(AREF) U5.38(VCC3) U6.10(VDD2B) U6.16(VDD2A) U7.10(VDD2B) U7.16(VDD2A) ; also sheet 1,3,7,8,9
BALL_SENSE: U5.43(PB3(AIN1/OC0)) ; also sheet 7
BB_RX: U5.37(PA0(ADC0)) ; also sheet 8
BB_TX: U5.13(PD4(OC1B)) ; also sheet 8
CHARGE: U5.14(PD5(OC1A)) ; also sheet 3
CHIP: R40.2 U5.41(PB1(T1)) ; also sheet 4
GND: C30.1 C31.1 C32.1 C33.1 C36.1 C37.1 R38.1 R39.1 R40.1 U5.6(GND1) U5.18(GND2) U5.28(GND3) U5.39(GND4) U6.3(V_IA) U6.9(GND2) U6.11(V_ID) U6.15(GND2) U7.3(V_IA) U7.9(GND2) U7.15(GND2) ; also sheet 1,2,3,4,5,7,8,9
GND_LGC_EXT: C34.1 C35.1 J4.3 U6.2(GND1) U6.8(GND1) U7.2(GND1) U7.8(GND1)
HV_IND_HIGH: U5.35(PA2(ADC2)) ; also sheet 7
HV_IND_LOW: U5.33(PA4(ADC4)) ; also sheet 7
HV_IND_MAX: U5.36(PA1(ADC1)) ; also sheet 7
HV_IND_MID: U5.34(PA3(ADC3)) ; also sheet 7
HV_IND_MIN: U5.32(PA5(ADC5)) ; also sheet 7
HV_SENSE_DIV_BR: R36.1 R37.2
KICK: R39.2 U5.40(PB0(XCK/T0)) ; also sheet 4
MCU_ERR: U5.25(PC6(TOSC1)) ; also sheet 7
MCU_INIT_OK: U5.30(PA7(ADC7)) ; also sheet 7
MCU_MODE: U5.26(PC7(TOSC2)) ; also sheet 7
MISO: U5.2(PB6(MISO)) U7.11(V_ID)
MISO_EXT: J4.8 U7.6(V_OD)
MODE_SELECT: U5.19(PC0(SCL)) ; also sheet 9
MOSI: U5.1(PB5(MOSI)) U7.12(V_OC)
MOSI_EXT: J4.7 U7.5(V_IC)
SCK: U5.3(PB7(SCK)) U7.13(V_OB)
SCK_EXT: J4.6 U7.4(V_IB)
V+: R36.2 ; also sheet 2,4,5,7
VCC_LGC_EXT: C34.2 C35.2 J4.2 U6.1(VDD1A) U6.7(VDD1B) U7.1(VDD1A) U7.7(VDD1B)
VMON: R37.1 R38.2 U5.31(PA6(ADC6))
Unconnected: J4.1 J4.LEG1 J4.LEG2 U5.7(XTAL2) U5.8(XTAL1) U5.9(PD0(RXD)) U5.10(PD1(TXD)) U5.20(PC1(SDA)) U5.21(PC2(TCK)) U5.22(PC3(TMS)) U5.23(PC4(TDO)) U5.24(PC5(TDI)) U6.6(V_OD) U6.14(V_OA) U7.14(V_OA)

### Notes on the sheet
- ATMEGA32
- Avoid JTAG pins
- Avoid JTAG pins
- Avoid JTAG pins
- Avoid JTAG pins
- Data Header | High Voltage Sense Divider
- R_up = 2 * 5.1E6 = 1.02E7 Ohms
  R_down = 1.02E3 Ohms
  Vmon_max_typ = 250V * (R_down/(R_up + R_down)) = 2.48V
  
  Max rated voltage for any pin on MCU is around 5V (input voltage),
  therefore the voltage divider can be adjusted to make VMON closer to 5V.
  But to account for the possibility of voltage spikes in excess of 600V,
  Vmon is adjusted to have the max typical voltage of around 2.5V

## Sheet 7 of 9: LED Indicators
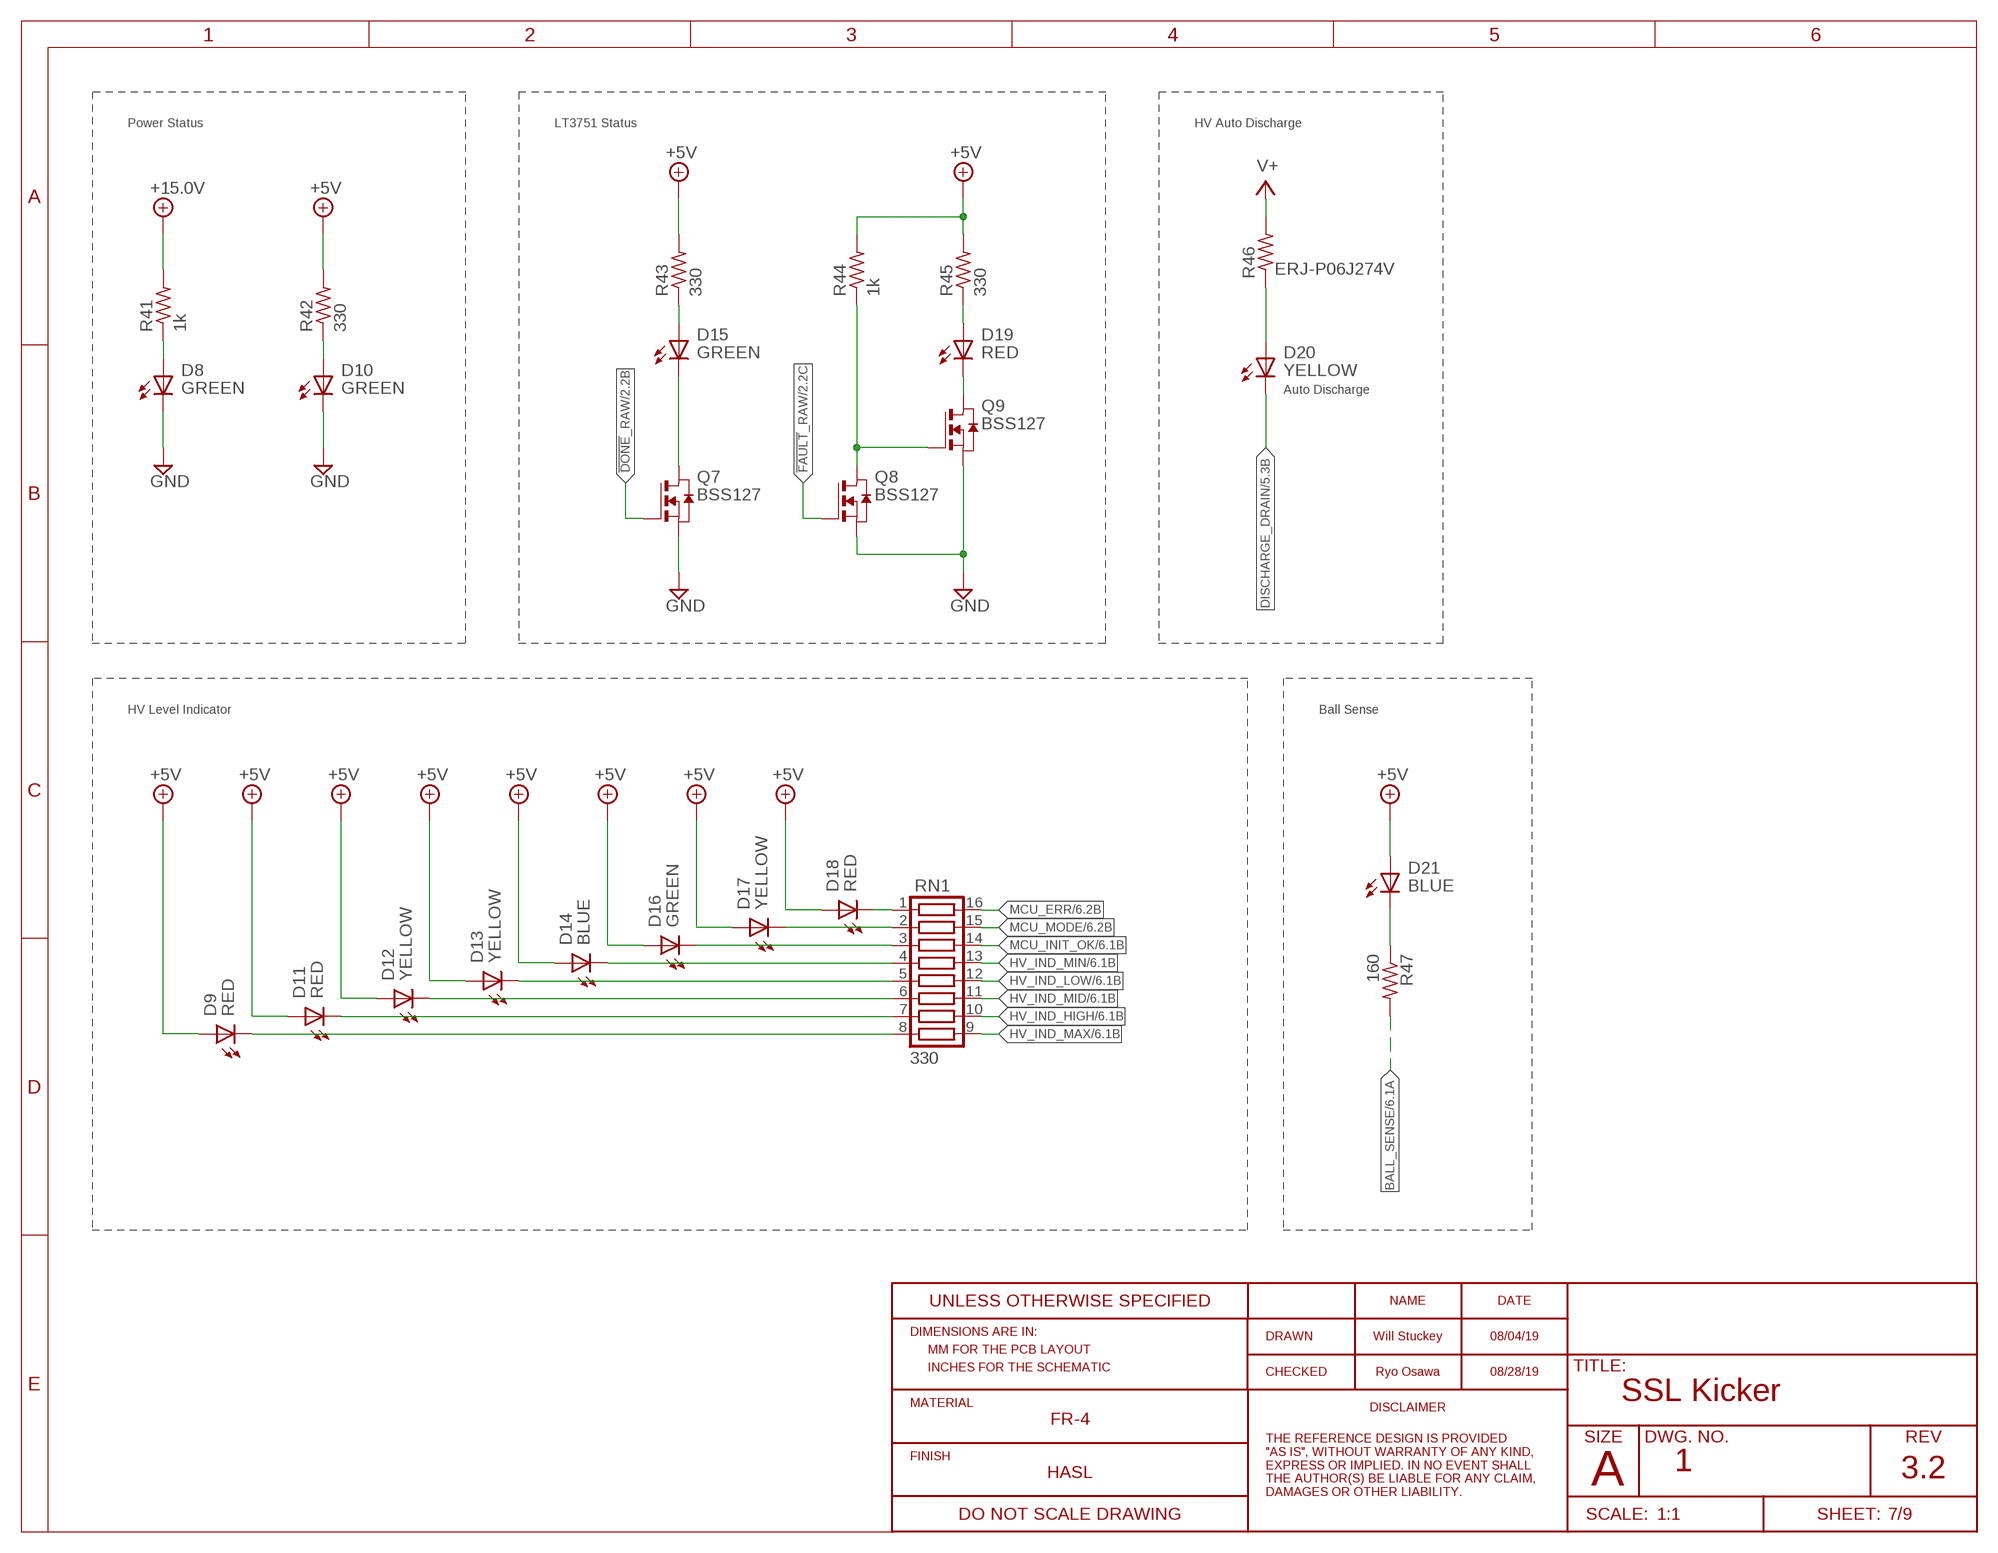
[diagram p6: schematic, sheet 7]
FRAME7 (RO_FRAME_A_L_20161226): REV: 3.2

### Parts
D8  GREEN  LED-SMD-GREEN  [CHIP-LED0603]
D9  RED  LED-SMD-RED  [CHIP-LED0603]
D10  GREEN  LED-SMD-GREEN  [CHIP-LED0603]
D11  RED  LED-SMD-RED  [CHIP-LED0603]
D12  YELLOW  LED-SMD-YELLOW  [CHIP-LED0603]
D13  YELLOW  LED-SMD-YELLOW  [CHIP-LED0603]
D14  BLUE  LED-SMD-BLUE  [CHIP-LED0603]
D15  GREEN  LED-SMD-GREEN  [CHIP-LED0603]
D16  GREEN  LED-SMD-GREEN  [CHIP-LED0603]
D17  YELLOW  LED-SMD-YELLOW  [CHIP-LED0603]
D18  RED  LED-SMD-RED  [CHIP-LED0603]
D19  RED  LED-SMD-RED  [CHIP-LED0603]
D20  YELLOW  LED-SMD-YELLOW  [CHIP-LED0603]
D21  BLUE  LED-SMD-BLUE  [CHIP-LED0603]
Q7  BSS127  [SOT-23-3]
Q8  BSS127  [SOT-23-3]
Q9  BSS127  [SOT-23-3]
R41  1k  R-US_R0603  [R0603]
R42  330  R-US_R0603  [R0603]
R43  330  R-US_R0603  [R0603]
R44  1k  R-US_R0603  [R0603]
R45  330  R-US_R0603  [R0603]
R46  ERJ-P06J274V  R-US_R0805  [R0805]
R47  160  R-US_R0603  [R0603]
RN1  330  RA-8  [RA-8_2506]

### Nets
15V_PWR_BR: D8.A R41.1
!DONE!_RAW: Q7.1(G) ; also sheet 2,3
!FAULT!_RAW: Q8.1(G) ; also sheet 2,3
+5V: D9.A D11.A D12.A D13.A D14.A D16.A D17.A D18.A D21.A R42.2 R43.2 R44.2 R45.2 ; also sheet 1,3,6,8,9
+15.0V: R41.2 ; also sheet 1,4
BALL_SENSE: R47.2 ; also sheet 6
BALL_SENSE_CL: D21.C(K) R47.1
DISCHARGE_DRAIN: D20.C(K) ; also sheet 5
FAULT_INV_BR: Q8.3(D) Q9.1(G) R44.1
GND: D8.C(K) D10.C(K) Q7.2(S) Q8.2(S) Q9.2(S) ; also sheet 1,2,3,4,5,6,8,9
HV_IND_HIGH: RN1.10 ; also sheet 6
HV_IND_HIGH_CL: D11.C(K) RN1.7
HV_IND_LOW: RN1.12 ; also sheet 6
HV_IND_LOW_CL: D13.C(K) RN1.5
HV_IND_MAX: RN1.9 ; also sheet 6
HV_IND_MAX_CL: D9.C(K) RN1.8
HV_IND_MID: RN1.11 ; also sheet 6
HV_IND_MID_CL: D12.C(K) RN1.6
HV_IND_MIN: RN1.13 ; also sheet 6
HV_IND_MIN_CL: D14.C(K) RN1.4
MCU_ERR: RN1.16 ; also sheet 6
MCU_ERR_CL: D18.C(K) RN1.1
MCU_INIT_OK: RN1.14 ; also sheet 6
MCU_INIT_OK_CL: D16.C(K) RN1.3
MCU_MODE: RN1.15 ; also sheet 6
MCU_MODE_CL: D17.C(K) RN1.2
N$5: D15.A R43.1
N$20: D10.A R42.1
N$27: D19.A R45.1
N$28: D19.C(K) Q9.3(D)
N$29: D20.A R46.1
N$37: D15.C(K) Q7.3(D)
V+: R46.2 ; also sheet 2,4,5,6

### Notes on the sheet
- Power Status | LT3751 Status | HV Auto Discharge
- Auto Discharge
- HV Level Indicator | Ball Sense

## Sheet 8 of 9: Breakbeam
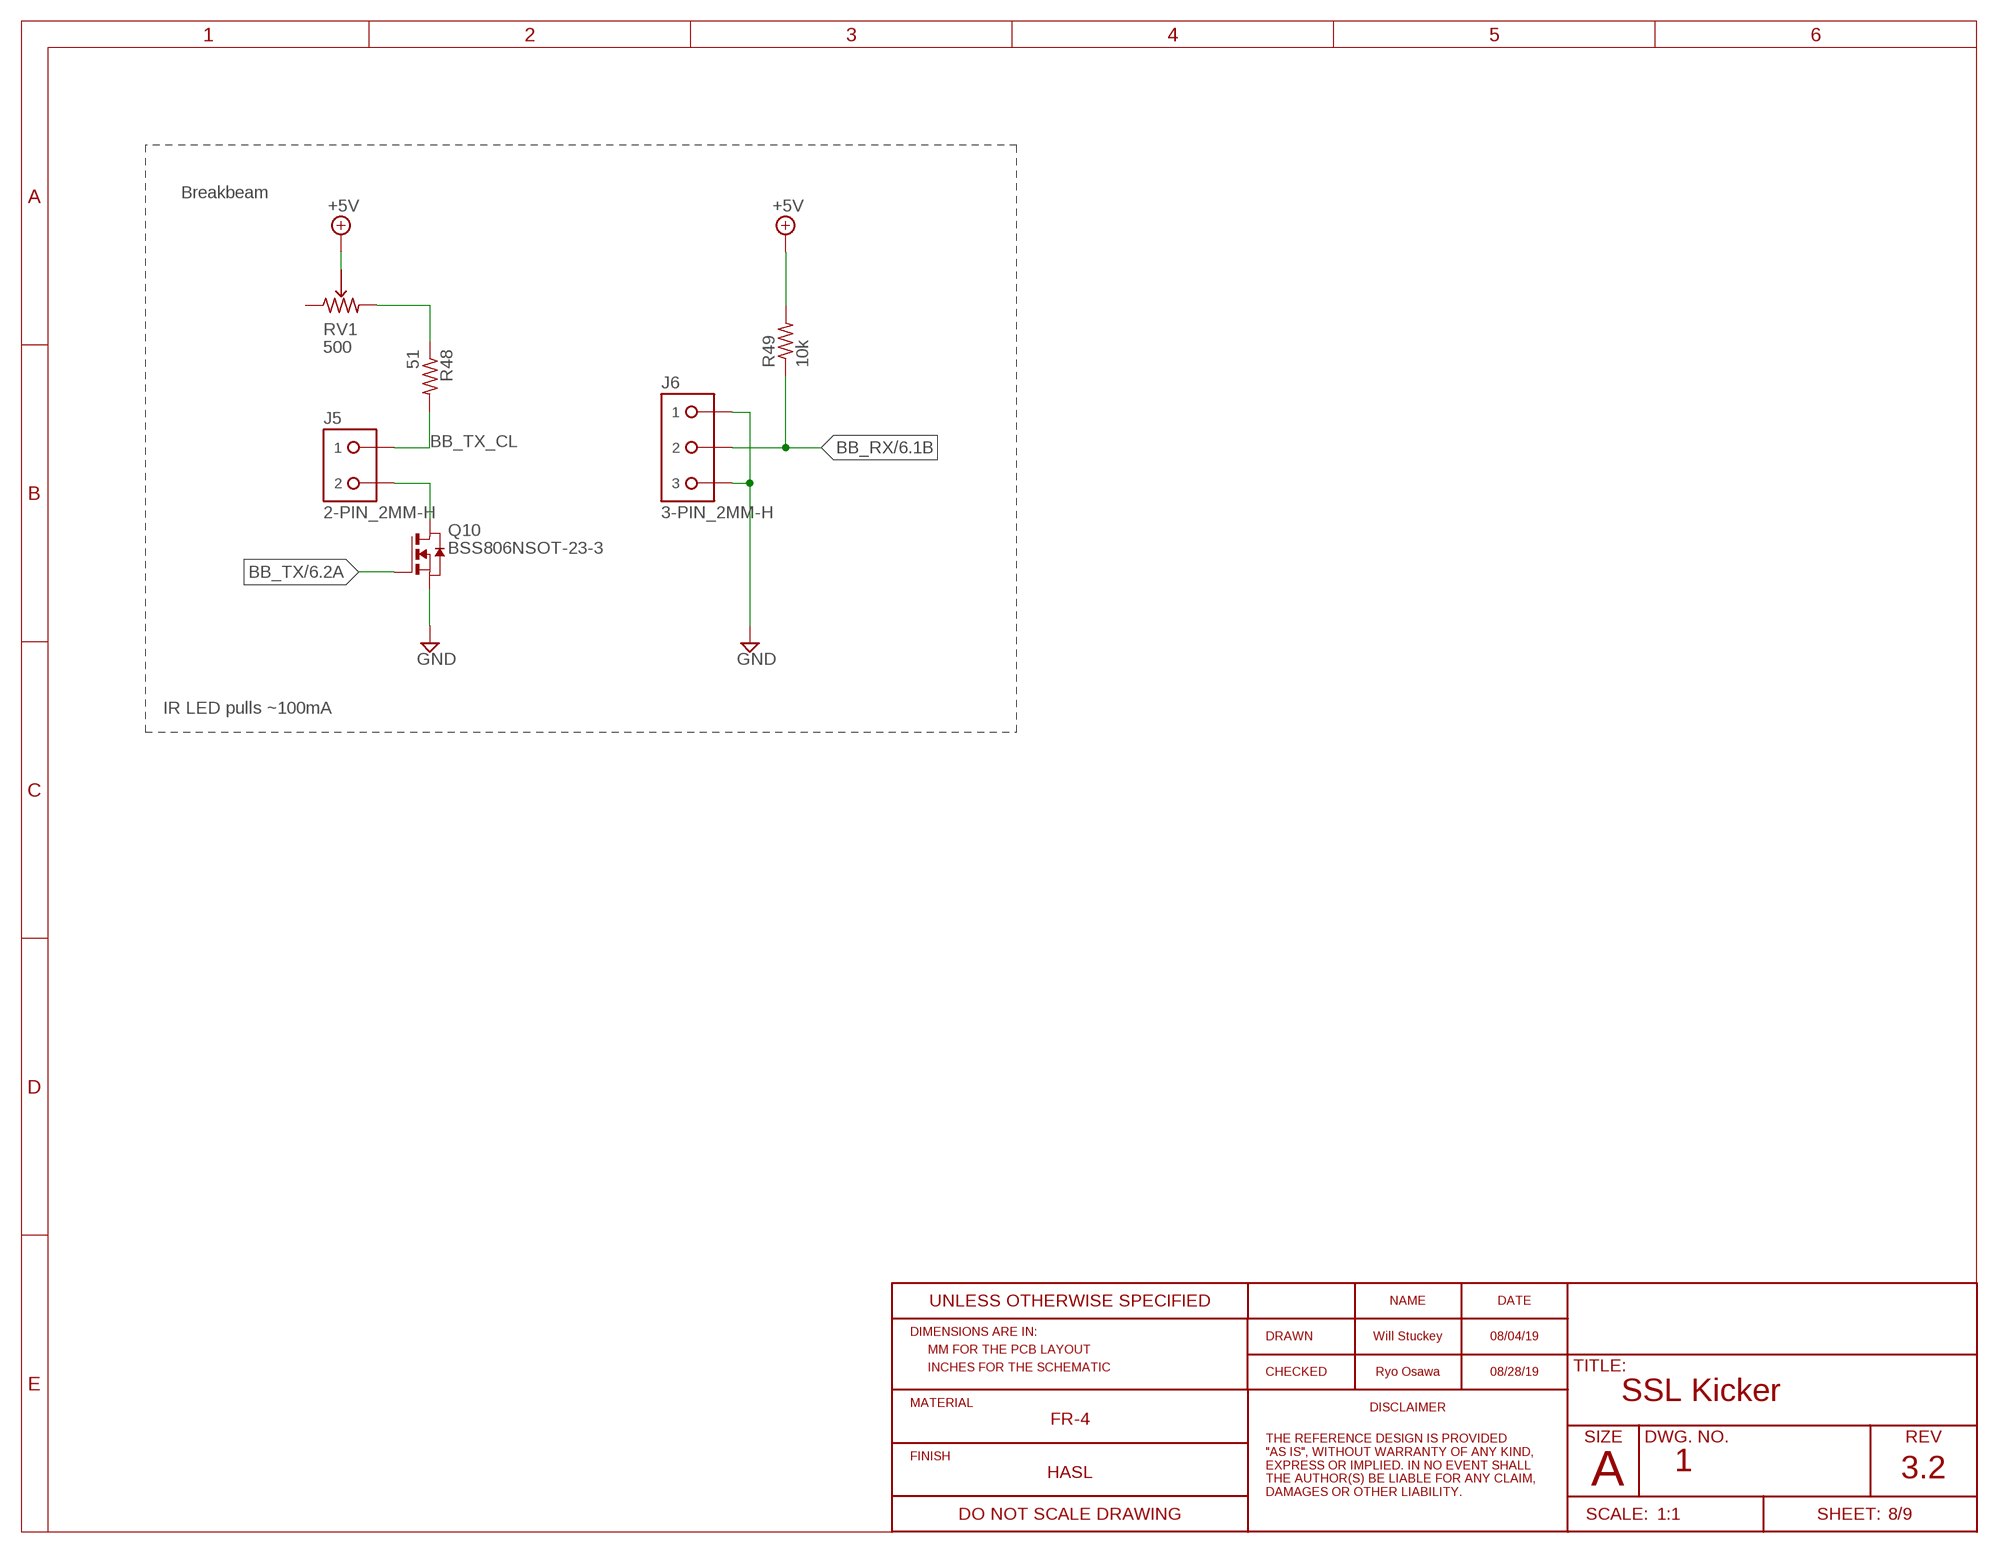
[diagram p7: schematic, sheet 8]
FRAME8 (RO_FRAME_A_L_20161226): REV: 3.2

### Parts
J5  2-PIN_2MM-H  [2MM-2-H]
J6  3-PIN_2MM-H  [2MM-3-H]
Q10  BSS806NSOT-23-3  [SOT95P240X110-3]
R48  51  R-US_R0603  [R0603]
R49  10k  R-US_R0603  [R0603]
RV1  500  PVG3  [PVG3G]

### Nets
+5V: R49.2 RV1.P$2(PIN2) ; also sheet 1,3,6,7,9
BB_RX: J6.2 R49.1 ; also sheet 6
BB_TX: Q10.1(G) ; also sheet 6
BB_TX_CL: J5.1 R48.2
GND: J6.1 J6.3 Q10.2(S) ; also sheet 1,2,3,4,5,6,7,9
N$3: R48.1 RV1.P$3(PIN3)
N$19: J5.2 Q10.3(D)
Unconnected: RV1.P$1(PIN1)

### Notes on the sheet
- Breakbeam
- IR LED pulls ~100mA

## Sheet 9 of 9: User Input
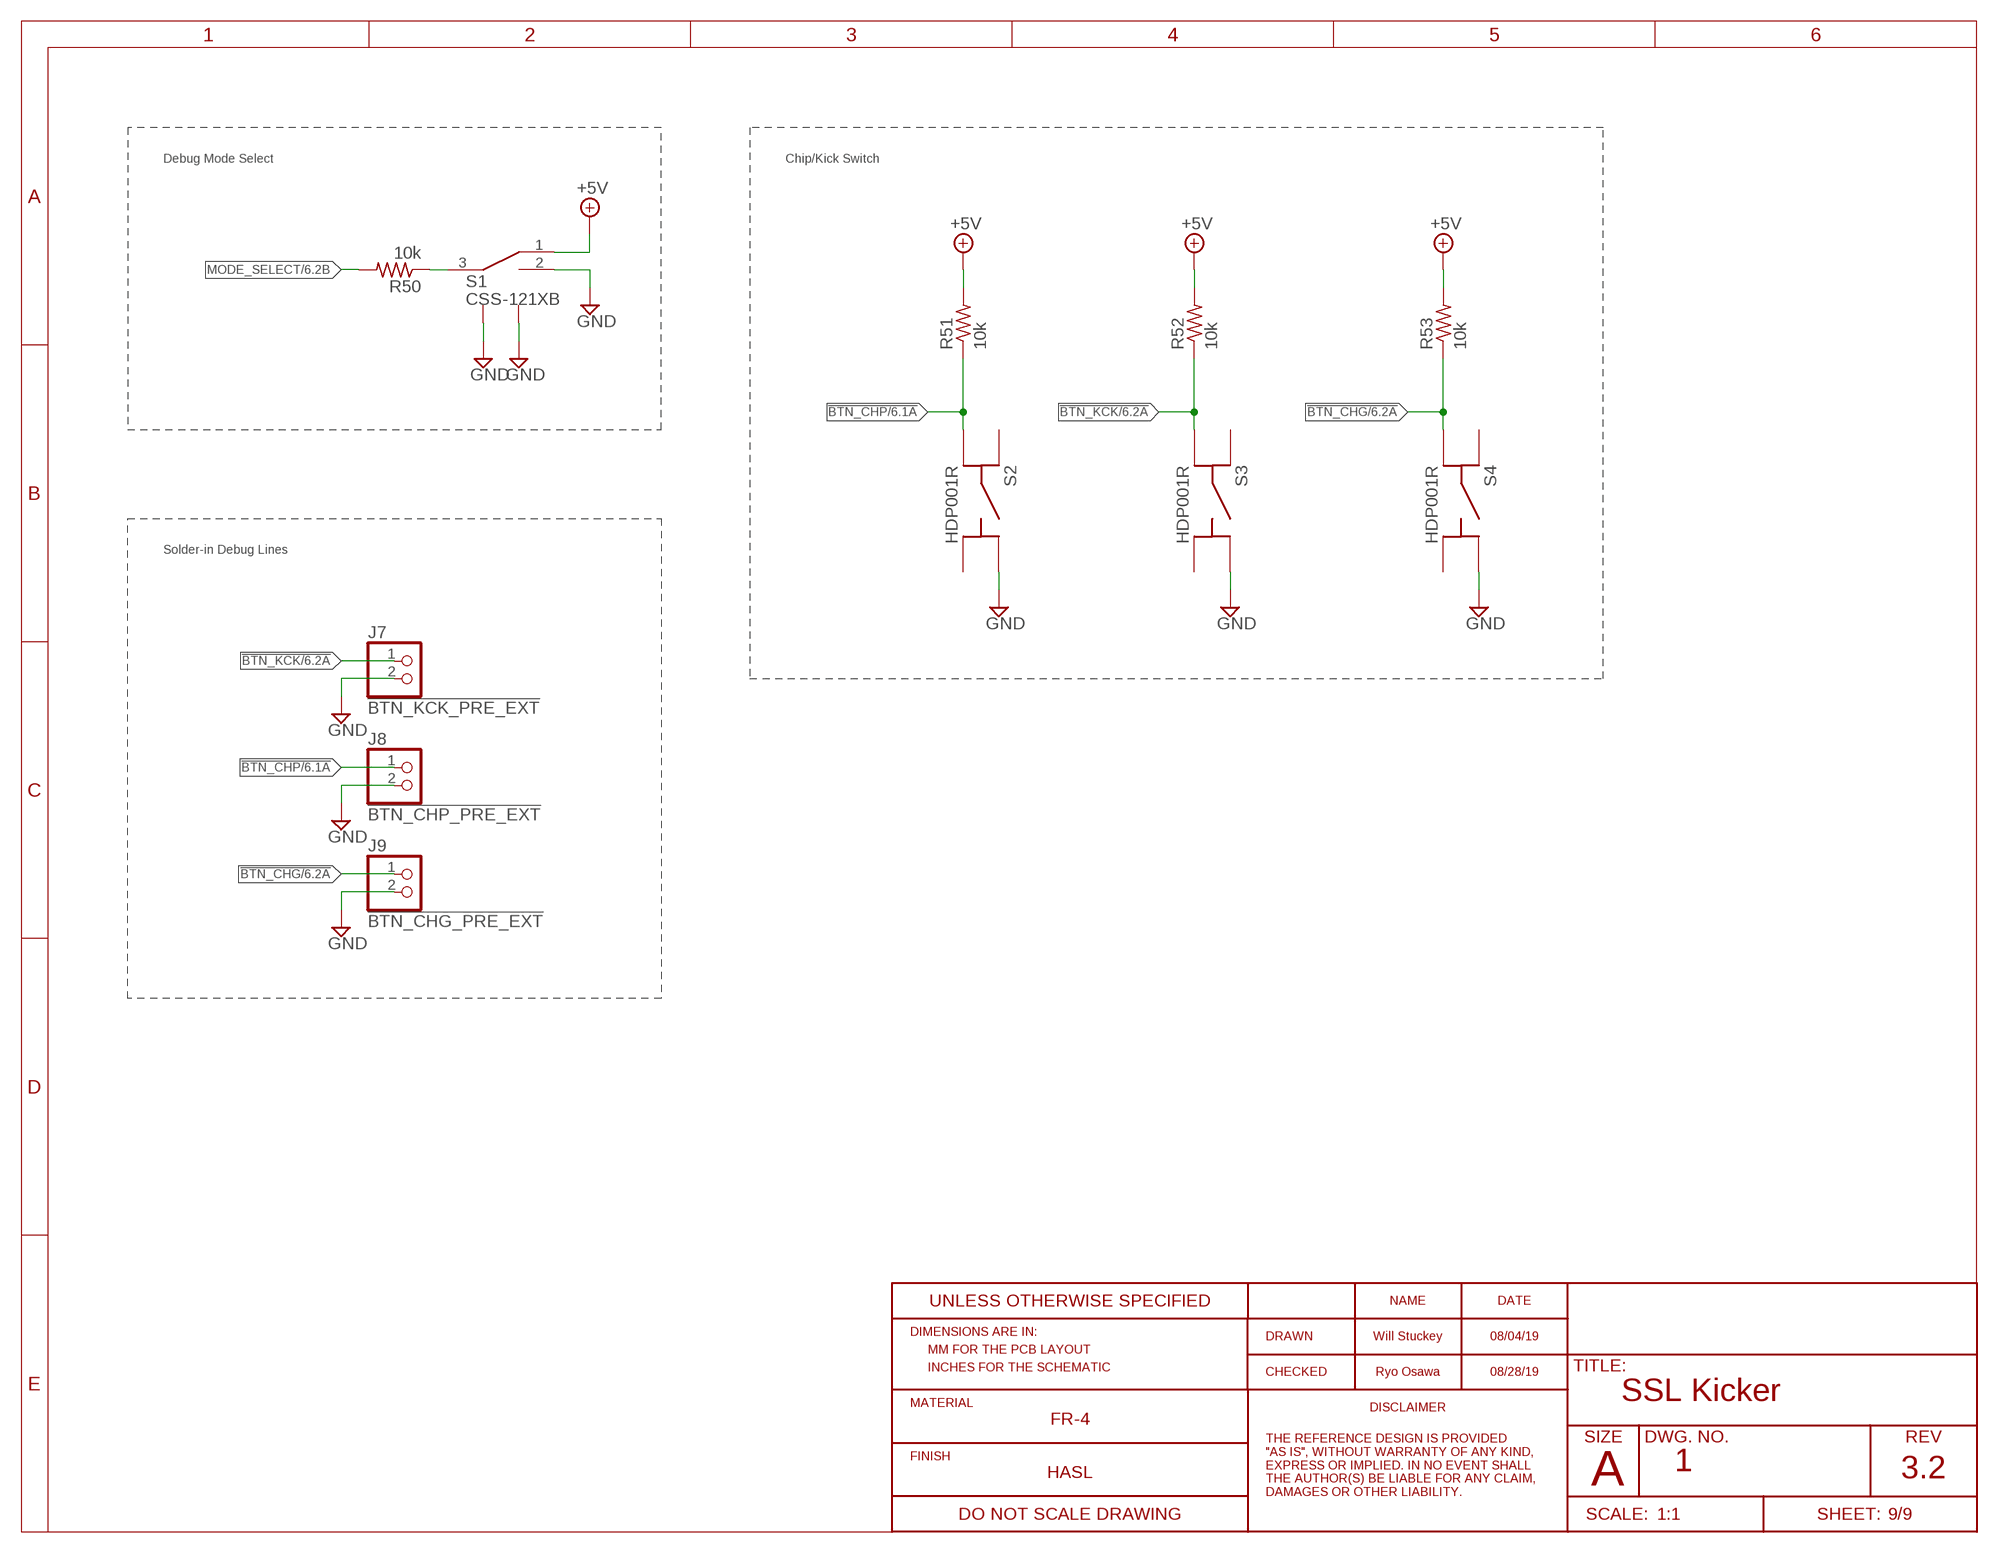
[diagram p8: schematic, sheet 9]

### Parts
J7  !BTN_KCK_PRE_EXT  CONN-2VERT  [1X2]
J8  !BTN_CHP_PRE_EXT  CONN-2VERT  [1X2]
J9  !BTN_CHG_PRE_EXT  CONN-2VERT  [1X2]
R50  10k  R-US_R0603  [R0603]
R51  10k  R-US_R0603  [R0603]
R52  10k  R-US_R0603  [R0603]
R53  10k  R-US_R0603  [R0603]
S1  CSS-121XB  [CSS-121XB]
S2  HDP001R  [HDP001R]
S3  HDP001R  [HDP001R]
S4  HDP001R  [HDP001R]

### Nets
!BTN_CHG: J9.1 R53.1 S4.C(A2) ; also sheet 6
!BTN_CHP: J8.1 R51.1 S2.C(A2) ; also sheet 6
!BTN_KCK: J7.1 R52.1 S3.C(A2) ; also sheet 6
+5V: R51.2 R52.2 R53.2 S1.1(A) ; also sheet 1,3,6,7,8
GND: J7.2 J8.2 J9.2 S1.2(B) S1.LEG1 S1.LEG4(LEG2) S2.B(B1) S3.B(B1) S4.B(B1) ; also sheet 1,2,3,4,5,6,7,8
MODE_SELECT: R50.2 ; also sheet 6
N$14: R50.1 S1.3(COMMON)
Unconnected: S2.A(A1) S2.D(B2) S3.A(A1) S3.D(B2) S4.A(A1) S4.D(B2)

### Notes on the sheet
- Debug Mode Select | Chip/Kick Switch
- Solder-in Debug Lines

## Library data of the parts
C1-C4 C9-C18 C20-C38 = rcl:C-US: CAPACITOR, American symbol; SPICEPREFIX: C
C5-C8 C19 = RoboJackets-Capacitors:CPOL-US: POLARIZED CAPACITOR, American symbol
D1 = RoboJackets-Diodes:TVS: Suppressor diode
D2 D5 D6 = RoboJackets-Diodes:VS-5EWH06FN-M3
D3 D4 = RoboJackets-Diodes:SMAJ20A
D7 = RoboJackets-Diodes:DIODE-: DIODE
D8 D10 D15 D16 = RoboJackets-LEDs:LED-SMD; DIGIKEY: 160-1446-1-ND; MPN: LTST-C191KGKT
D9 D11 D18 D19 = RoboJackets-LEDs:LED-SMD; DIGIKEY: 160-1447-1-ND; MPN: LTST-C191KRKT
D12 D13 D17 D20 = RoboJackets-LEDs:LED-SMD; DIGIKEY: 160-1448-1-ND; MPN: LTST-C191KSKT
D14 D21 = RoboJackets-LEDs:LED-SMD; DIGIKEY: 160-1647-1-ND; MPN: LTST-C191TBKT
J1-J3 = RoboJackets-Connectors:B2P?-VH(LF)(SN): Power Connector Brand: JST Sales America Inc. <https://www.jst.com/> Series: VH <http://www.digikey.com/product-search/en?FV=fff40016,fff802f3,ffec0e9d> Distributor: Digi-Key <http://www.digikey.com/product-detail/en/B2PS-VH%28LF%29%28SN%29/455-1648-ND/926555>; DIGIKEY: 455-1648-ND; MPN: B2PS-VH(LF)(SN)
J4 = RoboJackets-Connectors:HFW8; DIGIKEY: 609-1788-1-ND; MPN: HFW8R-1STE1LF
J5 = RoboJackets-Connectors:2-PIN_2MM-*; PINS: 2; PIN_PITCH: 2.0 mm
J6 = RoboJackets-Connectors:3-PIN_2MM-*; PINS: 3; PIN_PITCH: 2.0 mm
J7-J9 = RoboJackets-Connectors:CONN-2
Q1 = RoboJackets-Discrete:ATP302
Q2 = RoboJackets-Discrete:IRFS4227
Q3 Q4 = RoboJackets-Discrete:IXGK400N30A3
Q5 Q7-Q9 = RoboJackets-Discrete:BSS127
Q6 = RoboJackets-Discrete:AOD1N60
Q10 = RoboJackets-Discrete:BSS806N
R1-R33 R35-R54 = rcl:R-US_: RESISTOR, American symbol; SPICEPREFIX: R
R34 = RoboJackets-Resistors:PWR263S-35
RN1 = RoboJackets-Resistors:RA-8: Resistor Array 8; DIGIKEY: 742C163331JPCT-ND; MPN: 742C163331JP
RV1 = RoboJackets-Resistors:PVG3*; DIGIKEY_LINK: https://www.digikey.com/product-detail/en/bourns-inc/PVG3G501C01R00/PVG3G501C01R00CT-ND/6613133; DIGIKEY_PN: PVG3G501C01R00CT-ND; MANUFACTURER: Bourns; MPN: PVG3
S1 = RoboJackets-Switches:CSS-121XB
S2-S4 = RoboJackets-Switches:HDP001?
T1 = RoboJackets-Inductors:DA203X-AL
U1 = RoboJackets-PowerICs:MPM3620GQV-P
U2 = RoboJackets-PowerICs:MIC5235YM5
U3 = RoboJackets-ICs:LT3751
U4 = RoboJackets-PowerICs:IX4427
U5 = RoboJackets-ICs:AT32A
U6 = RoboJackets-ICs:ADUM744X*RQZ-RL7; DATA_RATE: 1 Mbps; DIGIKEY_PN: ADUM7441ARQZ-RL7CT-ND; MANUFACTURER: ANALOG DEVICES
U7 = RoboJackets-ICs:ADUM744X*RQZ-RL7; DATA_RATE: 25 Mbps; DIGIKEY_PN: ADUM7441CRQZ-RL7CT-ND; MANUFACTURER: ANALOG DEVICES
XF1 = RoboJackets-Fuses:3557-2; DIGIKEY: 36-3557-2-ND; MPN: 3557-2

## Net classes
0 default: clearance 0.205 mm